# Altium project SCH-45852_C.PrjPcb (part 3 of 3)

## Sheet 11 FREELINK.SchDoc
size 817 x 513 mm
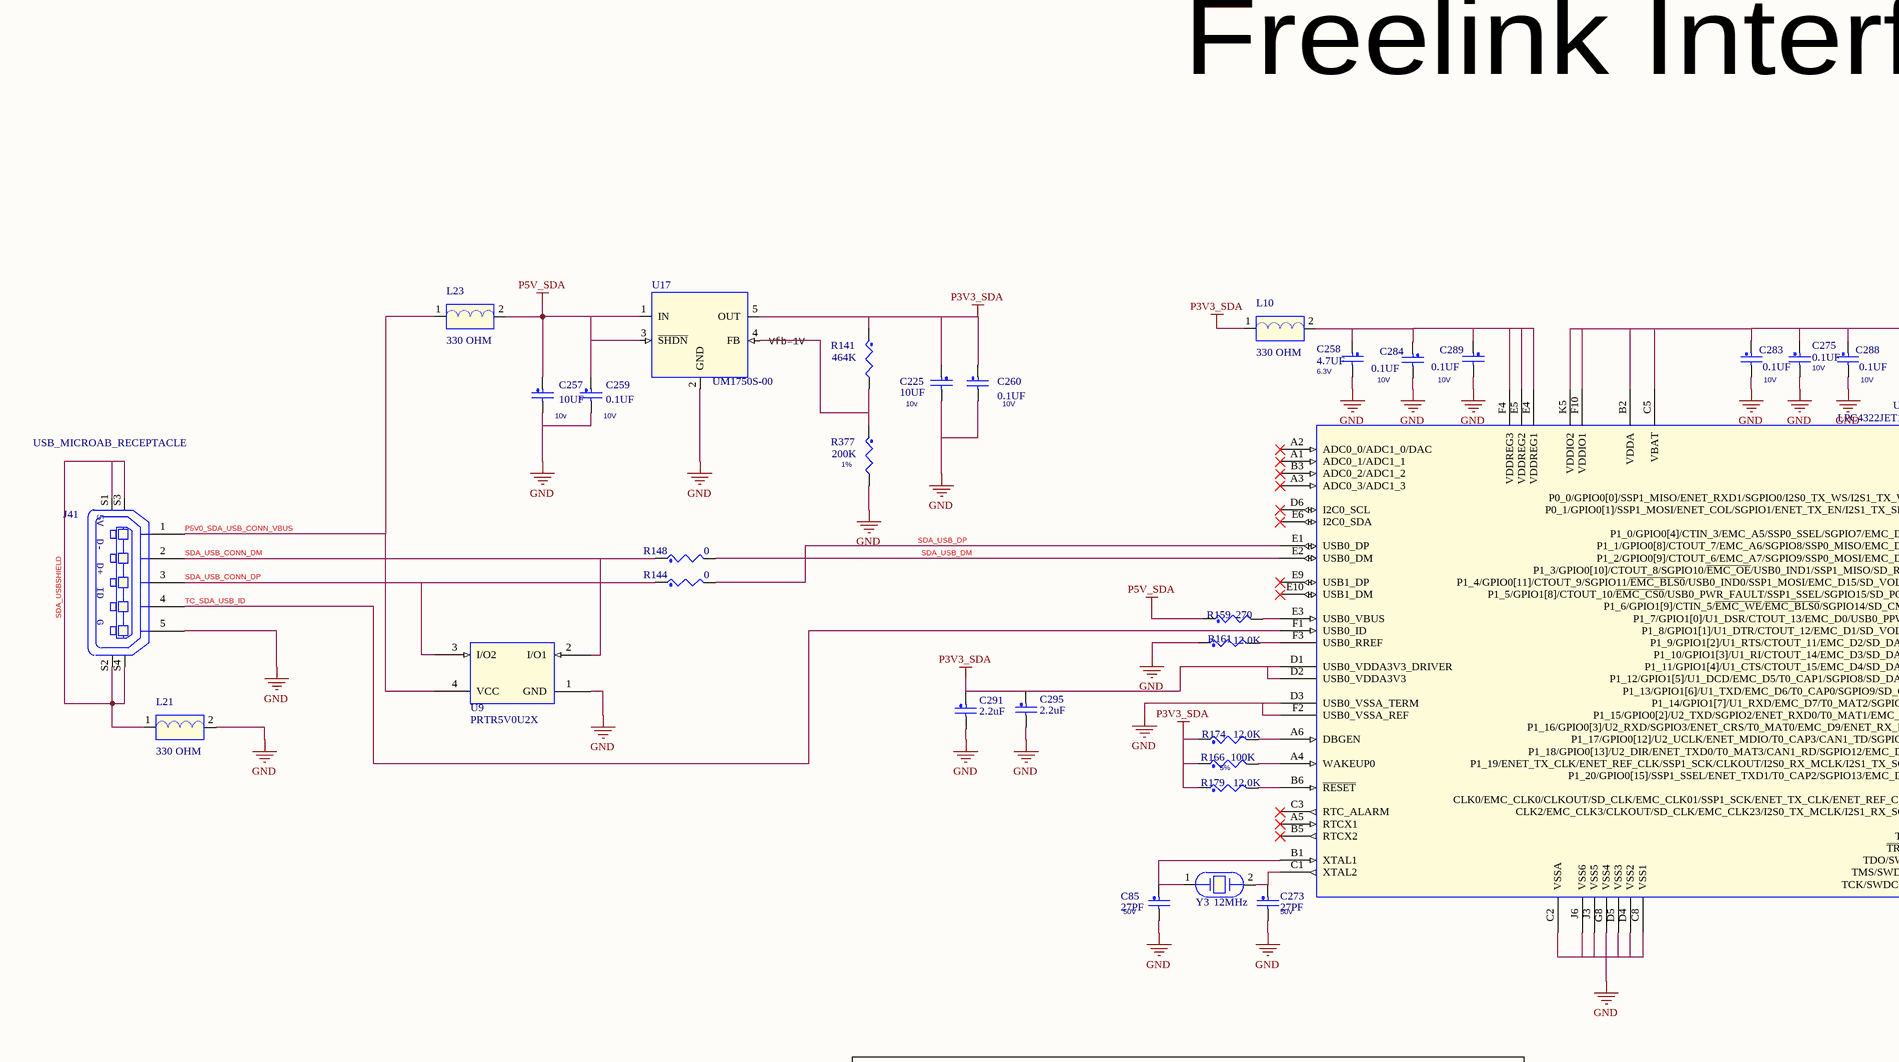
[diagram p12: 11 FREELINK.SchDoc, top left]
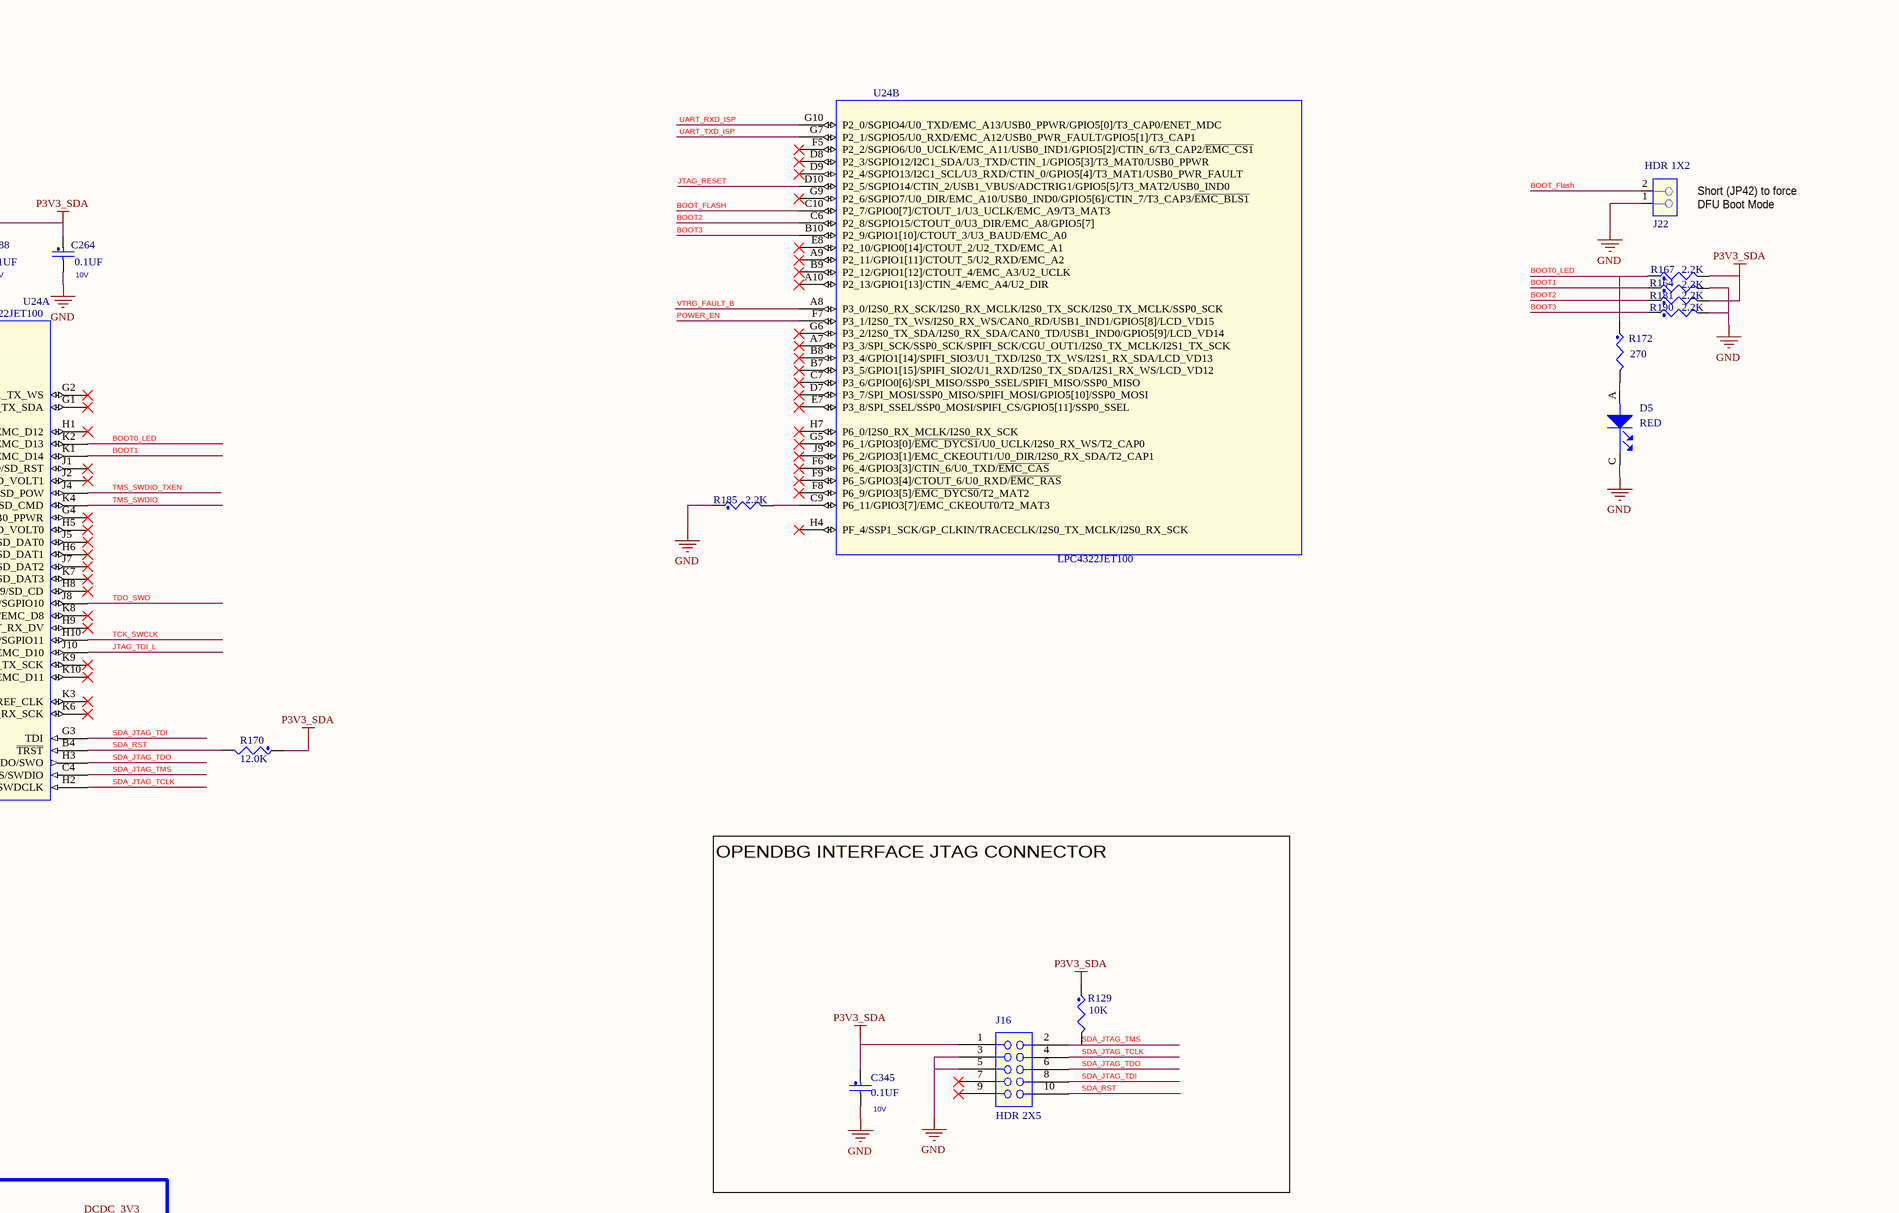
[diagram p13: 11 FREELINK.SchDoc, top right]
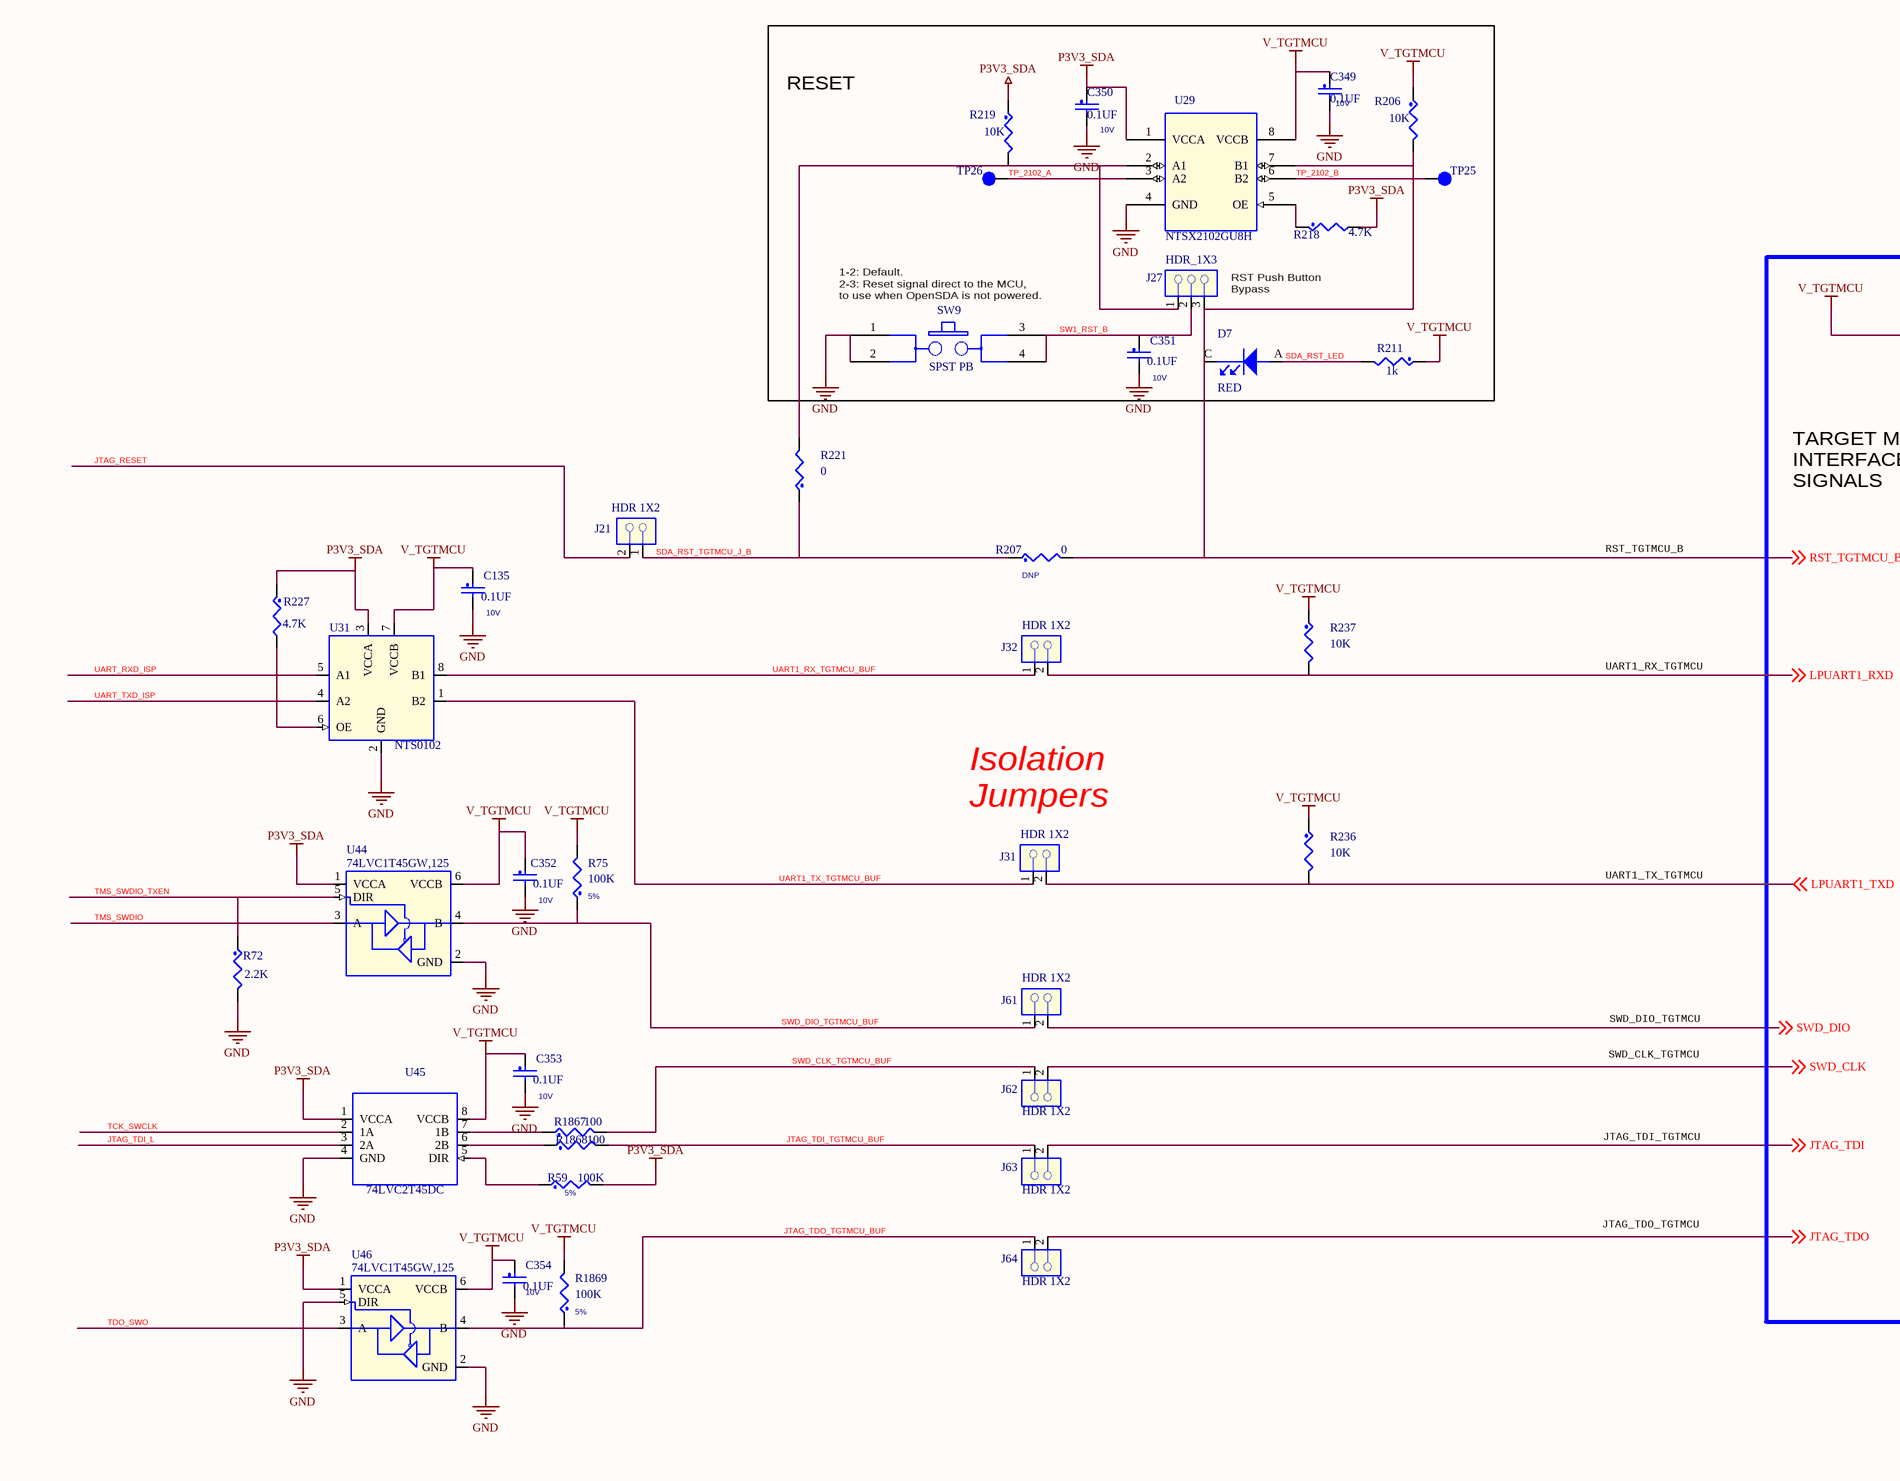
[diagram p14: 11 FREELINK.SchDoc, bottom left]
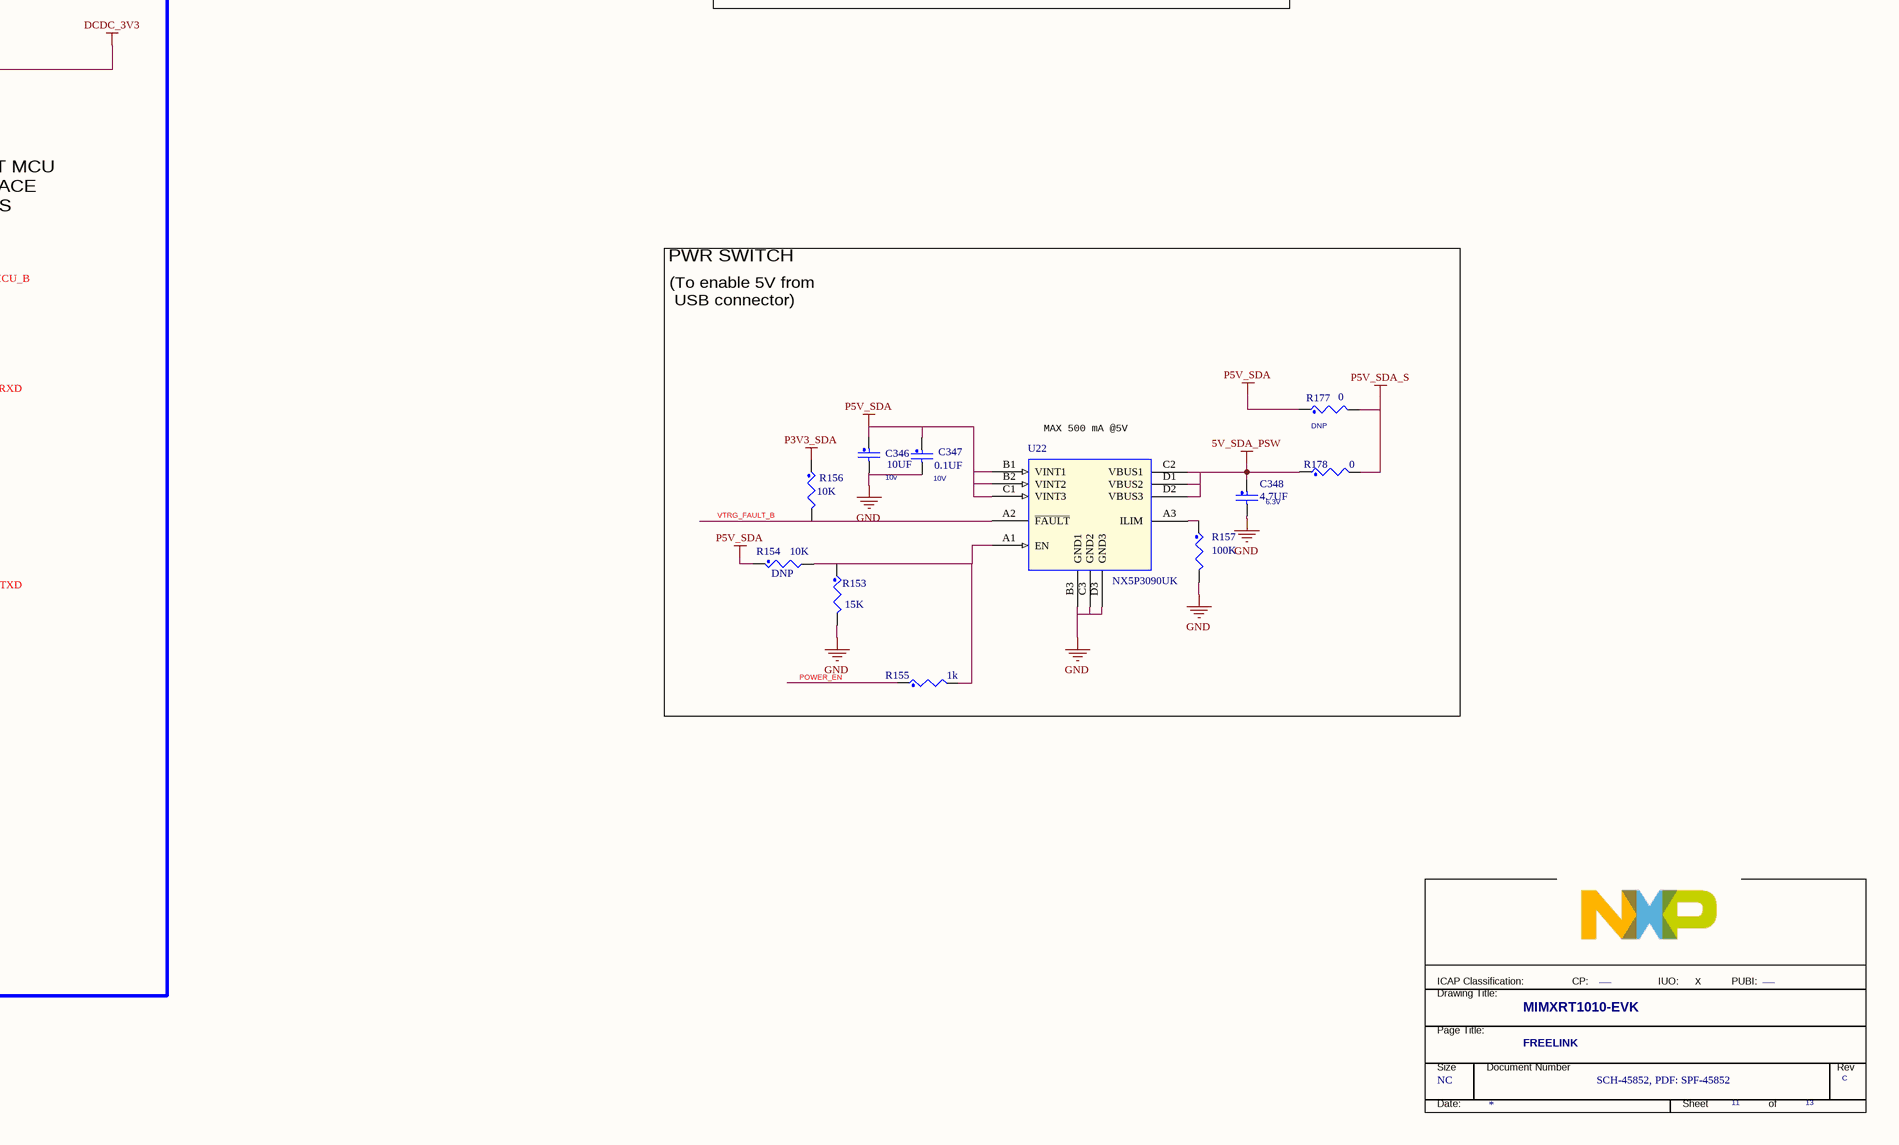
[diagram p15: 11 FREELINK.SchDoc, bottom right]

### Parts
(Parts that share a designator on the sheet are numbered #1, #2 ... from top to bottom, then left to right.)
*#11  PUBI: ___  Doc: SCH-45852, PDF: SPF-45852  RevCode: C  Title: MIMXRT1010-EVK  Page Size: NC  Page Number: 11  Page Count: 13  PageTitle: FREELINK  (hidden comment: TitleBlock_FS)  (graphical)
C85  27PF  VOLTAGE: 50V  [0402_CC]
C135  0.1UF  VOLTAGE: 10V  [0402_CC]
C225  10UF  VOLTAGE: 10v  [CC0603_OV]
C257  10UF  VOLTAGE: 10v  [CC0603_OV]
C258  4.7UF  voltage rating: 6.3V  [0402_CC]
C259  0.1UF  VOLTAGE: 10V  [0402_CC]
C260  0.1UF  VOLTAGE: 10V  [0402_CC]
C264  0.1UF  VOLTAGE: 10V  [0402_CC]
C273  27PF  VOLTAGE: 50V  [0402_CC]
C275  0.1UF  VOLTAGE: 10V  [0402_CC]
C283  0.1UF  VOLTAGE: 10V  [0402_CC]
C284  0.1UF  VOLTAGE: 10V  [0402_CC]
C288  0.1UF  VOLTAGE: 10V  [0402_CC]
C289  0.1UF  VOLTAGE: 10V  [0402_CC]
C291  2.2uF  [0402_CC]
C295  2.2uF  [0402_CC]
C345  0.1UF  VOLTAGE: 10V  [0402_CC]
C346  10UF  VOLTAGE: 10v  [CC0603_OV]
C347  0.1UF  VOLTAGE: 10V  [0402_CC]
C348  4.7UF  VOLTAGE: 6.3V  [0402_CC]
C349  0.1UF  VOLTAGE: 10V  [0402_CC]
C350  0.1UF  VOLTAGE: 10V  [0402_CC]
C351  0.1UF  VOLTAGE: 10V  [0402_CC]
C352  0.1UF  VOLTAGE: 10V  [0402_CC]
C353  0.1UF  VOLTAGE: 10V  [0402_CC]
C354  0.1UF  VOLTAGE: 10V  [0402_CC]
D5  RED  [LED_0603]
D7  RED  [LED_0603]
J16  HDR 2X5  [hdr205_50_th]
J21  HDR 1X2  [HDR102]
J22  HDR 1X2  [HDR102]
J27  HDR_1X3  [HDR103]
J31  HDR 1X2  [HDR102]
J32  HDR 1X2  [HDR102]
J41  USB_MICROAB_RECEPTACLE  [con_usb5_microab_0p65_sm]
J61  HDR 1X2  [HDR102]
J62  HDR 1X2  [HDR102]
J63  HDR 1X2  [HDR102]
J64  HDR 1X2  [HDR102]
L10  330 OHM  [ind_1608]
L21  330 OHM  [ind_1608]
L23  330 OHM  [ind_1608]
R59  100K  Tolerance: 5%  [0402_CC]
R72  2.2K  [0402_CC]
R75  100K  Tolerance: 5%  [0402_CC]
R129  10K  [0402_CC]
R141  464K  [0402_CC]
R144  0  [0402_CC]
R148  0  [0402_CC]
R153  15K  [0402_CC]
R154  10K  ASSY_OPT: DNP  [0402_CC]
R155  1k  [0402_CC]
R156  10K  [0402_CC]
R157  100K  [0402_CC]
R159  270  [0402_CC]
R161  12.0K  [0402_CC]
R164  2.2K  [0402_CC]
R166  100K  Tolerance: 5%  [0402_CC]
R167  2.2K  [0402_CC]
R170  12.0K  [0402_CC]
R172  270  [0402_CC]
R174  12.0K  [0402_CC]
R177  0  ASSY_OPT: DNP  [0402_CC]
R178  0  [0402_CC]
R179  12.0K  [0402_CC]
R181  2.2K  [0402_CC]
R185  2.2K  [0402_CC]
R190  2.2K  [0402_CC]
R206  10K  [0402_CC]
R207  0  ASSY_OPT: DNP  [0402_CC]
R211  1k  [0402_CC]
R218  4.7K  [0402_CC]
R219  10K  [0402_CC]
R221  0  [0402_CC]
R227  4.7K  [0402_CC]
R236  10K  [0402_CC]
R237  10K  [0402_CC]
R377  200K  Tolerance: 1%  [0402_CC]
R1867  100  [0402_CC]
R1868  100  [0402_CC]
R1869  100K  Tolerance: 5%  [0402_CC]
SW9  SPST PB  [SW4_PB_ESW_SM_P177]
TP25  TPAD_030  [TPAD_030]  (value not drawn)
TP26  TPAD_030  [TPAD_030]  (value not drawn)
U9  PRTR5V0U2X  [SOT143B]
U17  UM1750S-00  [sot23-5_a]
U22  NX5P3090UK  [wlcsp12_0p4_1p38x1p68mm_smdp]
U24  LPC4322JET100  [fbga100_0p8_9x9]  (parts A,B of 2)
U29  NTSX2102GU8H  [SO-8]
U31  NTS0102  [tssop8_a]
U44  74LVC1T45GW,125  [SOT-363_0P65_SMT]
U45  74LVC2T45DC  [SSOP8_DCU]
U46  74LVC1T45GW,125  [SOT-363_0P65_SMT]
Y3  12MHz  [xtl2_11p6x4p85_sm]

### Blocks framed on the sheet
OPENDBG INTERFACE JTAG CONNECTOR: C345 J16 R129
RESET: C349-C351 D7 J27 R206 R211 R218 R219 SW9 TP25 TP26 U29
PWR SWITCH: C346-C348 R153-R157 R177 R178 U22

### Nets
5V_SDA_PSW: C348.1 R178.1 U22.C2(VBUS1) U22.D1(VBUS2) U22.D2(VBUS3)
DCDC_3V3: C135.1 C349.1 C352.1 C353.1 C354.1 R75.2 R206.1 R211.1 R236.1 R237.1 R1869.2 U29.8(VCCB) U31.7(VCCB) U44.6(VCCB) U45.8(VCCB) U46.6(VCCB)  [also labelled V_TGTMCU]
GND: C85.2 C135.2 C225.2 C257.2 C258.2 C259.2 C260.2 C264.2 C273.2 C275.2 C283.2 C284.2 C288.2 C289.2 C291.2 C295.2 C345.2 C346.2 C347.2 C348.2 C349.2 C350.2 C351.2 C352.2 C353.2 C354.2 D5.C(CATHODE) J16.3(A2) J16.5(A3) J22.1 J41.5(P5) L21.2 R72.2 R153.2 R157.2 R161.1 R164.2 R185.1 R190.2 R377.2 SW9.1(A1) SW9.2(A2) U9.1(GND) U17.2(GND) U22.B3(GND1) U22.C3(GND2) U22.D3(GND3) U24.C2(VSSA) U24.C8(VSS1) U24.D3(USB0_VSSA_TERM) U24.D4(VSS2) U24.D5(VSS3) U24.F2(USB0_VSSA_REF) U24.G8(VSS4) U24.J3(VSS5) U24.J6(VSS6) U29.4(GND) U31.2(GND) U44.2(GND) U45.4(GND) U46.2(GND) U46.5(DIR)
P3V3_SDA: C225.1 C260.1 C264.1 C275.1 C283.1 C288.1 C291.1 C295.1 C345.1 C350.1 J16.1(A1) L10.1 R59.2 R129.1 R141.1 R156.1 R166.1 R167.2 R170.1 R174.1 R179.1 R181.2 R218.2 R219.1 R227.1 U17.5(OUT) U24.B2(VDDA) U24.C5(VBAT) U24.D1(USB0_VDDA3V3_DRIVER) U24.D2(USB0_VDDA3V3) U24.F10(VDDIO1) U24.K5(VDDIO2) U29.1(VCCA) U31.3(VCCA) U44.1(VCCA) U45.1(VCCA) U46.1(VCCA)
P5V_SDA: C257.1 C259.1 C346.1 C347.1 L23.2 R154.1 R159.1 R177.1 U17.1(IN) U17.3(~{SHDN}) U22.B1(VINT1) U22.B2(VINT2) U22.C1(VINT3)
P5V_SDA_S: R177.2 R178.2
BOOT0_LED: R167.1 R172.1 U24.K2(P1_1/GPIO0[8]/CTOUT_7/EMC_A6/SGPIO8/SSP0_MISO/EMC_D13)
BOOT1: R164.1 U24.K1(P1_2/GPIO0[9]/CTOUT_6/EMC_A7/SGPIO9/SSP0_MOSI/EMC_D14)
BOOT2: R181.1 U24.C6(P2_8/SGPIO15/CTOUT_0/U3_DIR/EMC_A8/GPIO5[7])
BOOT3: R190.1 U24.B10(P2_9/GPIO1[10]/CTOUT_3/U3_BAUD/EMC_A0)
BOOT_Flash: J22.2 U24.C10(P2_7/GPIO0[7]/CTOUT_1/U3_UCLK/EMC_A9/T3_MAT3)
JTAG_RESET: J21.2 U24.D10(P2_5/SGPIO14/CTIN_2/USB1_VBUS/ADCTRIG1/GPIO5[5]/T3_MAT2/USB0_IND0)
JTAG_TDI: J63.2 ; off-sheet JTAG_TDI
JTAG_TDI_L: U24.J10(P1_18/GPIO0[13]/U2_DIR/ENET_TXD0/T0_MAT3/CAN1_RD/SGPIO12/EMC_D10) U45.3(2A)
JTAG_TDI_TGTMCU_BUF: J63.1 R1868.2
JTAG_TDO: J64.2 ; off-sheet JTAG_TDO
JTAG_TDO_TGTMCU_BUF: J64.1 R1869.1 U46.4(B)
LPUART1_RXD: J32.2 R237.2 ; off-sheet LPUART1_RXD
LPUART1_TXD: J31.2 R236.2 ; off-sheet LPUART1_TXD
P5V0_SDA_USB_CONN_VBUS: J41.1(P1) L23.1 U9.4(VCC)
POWER_EN: R155.1 U24.F7(P3_1/I2S0_TX_WS/I2S0_RX_WS/CAN0_RD/USB1_IND1/GPIO5[8]/LCD_VD15)
RST_TGTMCU_B: D7.C(CATHODE) J27.3 R206.2 R207.2 U29.7(B1) ; off-sheet RST_TGTMCU_B  [project net POR_B]
SDA_JTAG_TCLK: J16.4(B2) U24.H2(TCK/SWDCLK)
SDA_JTAG_TDI: J16.8(B4) U24.G3(TDI)
SDA_JTAG_TDO: J16.6(B3) U24.H3(TDO/SWO)
SDA_JTAG_TMS: J16.2(B1) R129.2 U24.C4(TMS/SWDIO)
SDA_RST: J16.10(B5) R170.2 U24.B4(~{TRST})
SDA_RST_LED: D7.A(ANODE) R211.2
SDA_RST_TGTMCU_J_B: J21.1 R207.1 R221.1
SDA_USB_CONN_DM: J41.2(P2) R148.1 U9.2(I/O1)
SDA_USB_CONN_DP: J41.3(P3) R144.1 U9.3(I/O2)
SDA_USB_DM: R148.2 U24.E2(USB0_DM)
SDA_USB_DP: R144.2 U24.E1(USB0_DP)
SDA_USBSHIELD: J41.S1(SHLD1) J41.S2(SHLD2) J41.S3(SHLD3) J41.S4(SHLD4) L21.1
SW1_RST_B: C351.1 J27.2 SW9.3(B1) SW9.4(B2)
SWD_CLK: J62.2 ; off-sheet SWD_CLK  [project net JTAG_TCK]
SWD_CLK_TGTMCU_BUF: J62.1 R1867.2
SWD_DIO: J61.2 ; off-sheet SWD_DIO  [project net JTAG_TMS]
SWD_DIO_TGTMCU_BUF: J61.1 R75.1 U44.4(B)
TC_SDA_USB_ID: J41.4(P4) U24.F1(USB0_ID)
TCK_SWCLK: U24.H10(P1_17/GPIO0[12]/U2_UCLK/ENET_MDIO/T0_CAP3/CAN1_TD/SGPIO11) U45.2(1A)
TDO_SWO: U24.J8(P1_14/GPIO1[7]/U1_RXD/EMC_D7/T0_MAT2/SGPIO10) U46.3(A)
TMS_SWDIO: U24.K4(P1_6/GPIO1[9]/CTIN_5/~{EMC_WE}/~{EMC_BLS0}/SGPIO14/SD_CMD) U44.3(A)
TMS_SWDIO_TXEN: R72.1 U24.J4(P1_5/GPIO1[8]/CTOUT_10/~{EMC_CS0}/USB0_PWR_FAULT/SSP1_SSEL/SGPIO15/SD_POW) U44.5(DIR)
TP_2102_A: TP26.1(Pin1) U29.3(A2)
TP_2102_B: TP25.1(Pin1) U29.6(B2)
UART1_RX_TGTMCU_BUF: J32.1 U31.8(B1)
UART1_TX_TGTMCU_BUF: J31.1 U31.1(B2)
UART_RXD_ISP: U24.G10(P2_0/SGPIO4/U0_TXD/EMC_A13/USB0_PPWR/GPIO5[0]/T3_CAP0/ENET_MDC) U31.5(A1)
UART_TXD_ISP: U24.G7(P2_1/SGPIO5/U0_RXD/EMC_A12/USB0_PWR_FAULT/GPIO5[1]/T3_CAP1) U31.4(A2)
VTRG_FAULT_B: R156.2 U22.A2(~{FAULT}) U24.A8(P3_0/I2S0_RX_SCK/I2S0_RX_MCLK/I2S0_TX_SCK/I2S0_TX_MCLK/SSP0_SCK)
NetC85_1: C85.1 U24.B1(XTAL1) Y3.1
NetC258_1: C258.1 C284.1 C289.1 L10.2 U24.E4(VDDREG1) U24.E5(VDDREG2) U24.F4(VDDREG3)
NetC273_1: C273.1 U24.C1(XTAL2) Y3.2
NetD5_A: D5.A(ANODE) R172.2
NetJ27_1: J27.1 R219.2 R221.2 U29.2(A1)
NetR59_1: R59.1 U45.5(DIR)
NetR141_2: R141.2 R377.1 U17.4(FB)
NetR153_1: R153.1 R154.2 R155.2 U22.A1(EN)
NetR157_1: R157.1 U22.A3(ILIM)
NetR159_2: R159.2 U24.E3(USB0_VBUS)
NetR161_2: R161.2 U24.F3(USB0_RREF)
NetR166_2: R166.2 U24.A4(WAKEUP0)
NetR174_2: R174.2 U24.A6(DBGEN)
NetR179_2: R179.2 U24.B6(~{RESET})
NetR185_2: R185.2 U24.C9(P6_11/GPIO3[7]/EMC_CKEOUT0/T2_MAT3)
NetR218_1: R218.1 U29.5(OE)
NetR227_2: R227.2 U31.6(OE)
NetR1867_1: R1867.1 U45.7(1B)
NetR1868_1: R1868.1 U45.6(2B)

Not connected (* = marked no-connect by the designer): J16 7(A4)* 9(A5)*; U24 A1(ADC0_1/ADC1_1)* A2(ADC0_0/ADC1_0/DAC)* A3(ADC0_3/ADC1_3)* A5(RTCX1)* A7(P3_3/SPI_SCK/SSP0_SCK/SPIFI_SCK/CGU_OUT1/I2S0_TX_MCLK/I2S1_TX_SCK)* A9(P2_11/GPIO1[11]/CTOUT_5/U2_RXD/EMC_A2)* A10(P2_13/GPIO1[13]/CTIN_4/EMC_A4/U2_DIR)* B3(ADC0_2/ADC1_2)* B5(RTCX2)* B7(P3_5/GPIO1[15]/SPIFI_SIO2/U1_RXD/I2S0_TX_SDA/I2S1_RX_WS/LCD_VD12)* B8(P3_4/GPIO1[14]/SPIFI_SIO3/U1_TXD/I2S0_TX_WS/I2S1_RX_SDA/LCD_VD13)* B9(P2_12/GPIO1[12]/CTOUT_4/EMC_A3/U2_UCLK)* C3(RTC_ALARM)* C7(P3_6/GPIO0[6]/SPI_MISO/SSP0_SSEL/SPIFI_MISO/SSP0_MISO)* D6(I2C0_SCL)* D7(P3_7/SPI_MOSI/SSP0_MISO/SPIFI_MOSI/GPIO5[10]/SSP0_MOSI)* D8(P2_3/SGPIO12/I2C1_SDA/U3_TXD/CTIN_1/GPIO5[3]/T3_MAT0/USB0_PPWR)* D9(P2_4/SGPIO13/I2C1_SCL/U3_RXD/CTIN_0/GPIO5[4]/T3_MAT1/USB0_PWR_FAULT)* E6(I2C0_SDA)* E7(P3_8/SPI_SSEL/SSP0_MOSI/SPIFI_CS/GPIO5[11]/SSP0_SSEL)* E8(P2_10/GPIO0[14]/CTOUT_2/U2_TXD/EMC_A1)* E9(USB1_DP)* E10(USB1_DM)* F5(P2_2/SGPIO6/U0_UCLK/EMC_A11/USB0_IND1/GPIO5[2]/CTIN_6/T3_CAP2/~{EMC_CS1})* F6(P6_4/GPIO3[3]/CTIN_6/U0_TXD/~{EMC_CAS})* F8(P6_9/GPIO3[5]/~{EMC_DYCS0}/T2_MAT2)* F9(P6_5/GPIO3[4]/CTOUT_6/U0_RXD/~{EMC_RAS})* G1(P0_1/GPIO0[1]/SSP1_MOSI/ENET_COL/SGPIO1/ENET_TX_EN/I2S1_TX_SDA)* G2(P0_0/GPIO0[0]/SSP1_MISO/ENET_RXD1/SGPIO0/I2S0_TX_WS/I2S1_TX_WS)* G4(P1_7/GPIO1[0]/U1_DSR/CTOUT_13/EMC_D0/USB0_PPWR)* G5(P6_1/GPIO3[0]/~{EMC_DYCS1}/U0_UCLK/I2S0_RX_WS/T2_CAP0)* G6(P3_2/I2S0_TX_SDA/I2S0_RX_SDA/CAN0_TD/USB1_IND0/GPIO5[9]/LCD_VD14)* G9(P2_6/SGPIO7/U0_DIR/EMC_A10/USB0_IND0/GPIO5[6]/CTIN_7/T3_CAP3/~{EMC_BLS1})* H1(P1_0/GPIO0[4]/CTIN_3/EMC_A5/SSP0_SSEL/SGPIO7/EMC_D12)* H4(PF_4/SSP1_SCK/GP_CLKIN/TRACECLK/I2S0_TX_MCLK/I2S0_RX_SCK)* H5(P1_8/GPIO1[1]/U1_DTR/CTOUT_12/EMC_D1/SD_VOLT0)* H6(P1_10/GPIO1[3]/U1_RI/CTOUT_14/EMC_D3/SD_DAT1)* H7(P6_0/I2S0_RX_MCLK/I2S0_RX_SCK)* H8(P1_13/GPIO1[6]/U1_TXD/EMC_D6/T0_CAP0/SGPIO9/SD_CD)* H9(P1_16/GPIO0[3]/U2_RXD/SGPIO3/ENET_CRS/T0_MAT0/EMC_D9/ENET_RX_DV)* J1(P1_3/GPIO0[10]/CTOUT_8/SGPIO10/~{EMC_OE}/USB0_IND1/SSP1_MISO/SD_RST)* J2(P1_4/GPIO0[11]/CTOUT_9/SGPIO11/~{EMC_BLS0}/USB0_IND0/SSP1_MOSI/EMC_D15/SD_VOLT1)* J5(P1_9/GPIO1[2]/U1_RTS/CTOUT_11/EMC_D2/SD_DAT0)* J7(P1_11/GPIO1[4]/U1_CTS/CTOUT_15/EMC_D4/SD_DAT2)* J9(P6_2/GPIO3[1]/EMC_CKEOUT1/U0_DIR/I2S0_RX_SDA/T2_CAP1)* K3(CLK0/EMC_CLK0/CLKOUT/SD_CLK/EMC_CLK01/SSP1_SCK/ENET_TX_CLK/ENET_REF_CLK)* K6(CLK2/EMC_CLK3/CLKOUT/SD_CLK/EMC_CLK23/I2S0_TX_MCLK/I2S1_RX_SCK)* K7(P1_12/GPIO1[5]/U1_DCD/EMC_D5/T0_CAP1/SGPIO8/SD_DAT3)* K8(P1_15/GPIO0[2]/U2_TXD/SGPIO2/ENET_RXD0/T0_MAT1/EMC_D8)* K9(P1_19/ENET_TX_CLK/ENET_REF_CLK/SSP1_SCK/CLKOUT/I2S0_RX_MCLK/I2S1_TX_SCK)* K10(P1_20/GPIO0[15]/SSP1_SSEL/ENET_TXD1/T0_CAP2/SGPIO13/EMC_D11)*

### Notes on the sheet
- Freelink Interface
- Short (JP42) to force
  DFU Boot Mode
- (near U17) Vfb=1V
- (near SW9) 1-2: Default.
  2-3: Reset signal direct to the MCU,
  to use when OpenSDA is not powered.
- RST Push Button
  Bypass
- TARGET MCU
  INTERFACE
  SIGNALS
- RST_TGTMCU_B
- (To enable 5V from
  USB connector)
- UART1_RX_TGTMCU
- Isolation
  Jumpers
- (near U22) MAX 500 mA @5V
- UART1_TX_TGTMCU
- SWD_DIO_TGTMCU
- SWD_CLK_TGTMCU
- JTAG_TDI_TGTMCU
- JTAG_TDO_TGTMCU
- X
- (in symbol TitleBlock_FS) ICAP Classification:; CP:; IUO:; PUBI:; Drawing Title:; Page Title:; Size; Document Number; Rev; Date:; Sheet; of
- (in symbol USB_MINI_AB_RECEPTACLE) 5V; D-; D+; ID; G

### Library data of the parts
*#11 = TitleBlock_FS: FIUO: _X_; OrgAddr2: Austin, TX 78735-8598; OrgAddr1: 6501 William Cannon Drive West; OrgName: Freescale Semiconductor; FCP: ___; Page Create Date: March  8, 1995; Page Modify Date: *
C85 = CAP_NP: CAP CER 27PF 50V 5% C0G 0402; CLASS: DISCRETE; FPLIST: CC0402_25,CC0402_HD,0402_CC; CAD_APPROVED: Yes; MFG_PN01: C0402C270J5GAC; MFG_NAME01: KEMET; AGILE_PN: 150-30109; HEIGHT: .55mm; ROHS: Yes; Tolerance: 5%; PCB Footprint: 0402_CC
C135 C283 C284 C345 C352-C354 = CAP_NP: CAP CER 0.1UF 10V 10% X5R 0402; CLASS: DISCRETE; AGILE_PN: 150-75634; MFG_NAME01: YAGEO AMERICA; MFG_PN01: CC0402KRX5R6BB104; CAD_APPROVED: Yes; FPLIST: CC0402_25,CC0402_HD,0402_CC; Tolerance: 10%; ROHS: Yes; HEIGHT: 0.64MM; PCB Footprint: 0402_CC
C225 C346 = CAP_NP: CAP CER 10UF 10V 10% X5R 0603; CLASS: DISCRETE; FPLIST: CC0603_OV,CC0603,0603_CC; CAD_APPROVED: Yes; Temp_Range: -55¡ãC ~ 85¡ãC; MFG_PN01: GRM188R61A106KE69D; MFG_NAME01: MURATA; AGILE_PN: 150-78675; HEIGHT: 1.016MM; ROHS: Yes; Tolerance: 10%; PCB Footprint: CC0603_OV
C257 = CAP_NP: CAP CER 10UF 10V 10% X5R 0603; CLASS: DISCRETE; AGILE_PN: 150-78675; MFG_NAME01: MURATA; MFG_PN01: GRM188R61A106KE69D; Temp_Range: -55¡ãC ~ 85¡ãC; CAD_APPROVED: Yes; FPLIST: CC0603_OV,CC0603,0603_CC; Tolerance: 10%; ROHS: Yes; HEIGHT: 1.016MM; PCB Footprint: CC0603_OV
C258 C348 = CAP_NP: CAP CER 4.7UF 6.3V 20% X5R 0402; CLASS: DISCRETE; AGILE_PN: 150-78463; MFG_NAME01: TDK; MFG_PN01: C1005X5R0J475M050BC; CAD_APPROVED: Yes; FPLIST: CC0402_25,CC0402_HD,0402_CC; Tolerance: 20%; ROHS: Yes; HEIGHT: 0.65MM; PCB Footprint: 0402_CC
  C258: VOLTAGE: 6.3V
  C348: TOL: 20%
C259 C260 C264 C275 C288 C289 C347 C349-C351 = CAP_NP: CAP CER 0.1UF 10V 10% X5R 0402; CLASS: DISCRETE; FPLIST: CC0402_25,CC0402_HD,0402_CC; CAD_APPROVED: Yes; MFG_PN01: CC0402KRX5R6BB104; MFG_NAME01: YAGEO AMERICA; AGILE_PN: 150-75634; HEIGHT: 0.64MM; ROHS: Yes; Tolerance: 10%; PCB Footprint: 0402_CC
C273 = CAP_NP: CAP CER 27PF 50V 5% C0G 0402; CLASS: DISCRETE; AGILE_PN: 150-30109; MFG_NAME01: KEMET; MFG_PN01: C0402C270J5GAC; CAD_APPROVED: Yes; FPLIST: CC0402_25,CC0402_HD,0402_CC; Tolerance: 5%; ROHS: Yes; HEIGHT: .55mm; PCB Footprint: 0402_CC
C291 = CAP_NP: CAP CER 2.2uF 6.3V 10% X5R 0402; CLASS: DISCRETE; FPLIST: CC0402_25,CC0402_HD,0402_CC; CAD_APPROVED: Yes; MFG_PN01: GRM155R60J225KE01D; MFG_NAME01: MURATA; AGILE_PN: 150-79454; VOLTAGE: 6.3V; HEIGHT: 0.55MM; ROHS: Yes; Tolerance: 10%; PCB Footprint: 0402_CC
C295 = CAP_NP: CAP CER 2.2uF 6.3V 10% X5R 0402; CLASS: DISCRETE; AGILE_PN: 150-79454; MFG_NAME01: MURATA; MFG_PN01: GRM155R60J225KE01D; CAD_APPROVED: Yes; FPLIST: CC0402_25,CC0402_HD,0402_CC; Tolerance: 10%; ROHS: Yes; HEIGHT: 0.55MM; VOLTAGE: 6.3V; PCB Footprint: 0402_CC
D5 D7 = LED: LED ULTRA BRIGHT RED SGL 30MA 0603; CLASS: IC; AGILE_PN: 370-75079; MFG_NAME01: LITE ON; MFG_PN01: LTST-C190KRKT; CAD_APPROVED: Yes; Temp_Range: -30¡ã C to + 85¡ã C; ROHS: Yes; HEIGHT: 0.9MM; PCB Footprint: LED_0603
J16 = CONN_HDR_5X2: HDR 2X5 TH 50MIL CTR 172H AU 91L; CLASS: IO; AGILE_PN: 210-81466; MFG_NAME01: ANYTRONIC CORPORATION LIMITED; MFG_PN01: 0922S0205011N9T-31RF; Temp_Range: -55DegC to +105DegC; CAD_APPROVED: Yes; ROHS: Yes; HEIGHT: 4.38MM; PCB Footprint: hdr205_50_th
J21 J32 J61 = CONN_HDR_2X1: HDR 1X2 TH 100MIL SP 339H AU 98L; CLASS: IO; AGILE_PN: 210-81490; MFG_NAME01: ANYTRONIC CORPORATION LIMITED; MFG_PN01: 0901S0202011N9T-31RF; Temp_Range: -55¡ãC to +105¡ãC; CAD_APPROVED: Yes; ROHS: Yes; HEIGHT: 8.59MM; PCB Footprint: HDR102
J22 J31 J62-J64 = CONN_HDR_2X1: HDR 1X2 TH 100MIL SP 339H AU 98L; CLASS: IO; CAD_APPROVED: Yes; Temp_Range: -55¡ãC to +105¡ãC; MFG_PN01: 0901S0202011N9T-31RF; MFG_NAME01: ANYTRONIC CORPORATION LIMITED; AGILE_PN: 210-81490; HEIGHT: 8.59MM; ROHS: Yes; PCB Footprint: HDR102
J27 = CONN_HDR_3X1: HDR 1X3 TH 100MIL SP 338H AU 98L; CLASS: IO; AGILE_PN: 210-81491; MFG_NAME01: ANYTRONIC CORPORATION LIMITED; MFG_PN01: 0901S0203011N9T-31RF; Temp_Range: -55¡ãC to +105¡ãC; CAD_APPROVED: Yes; ROHS: Yes; HEIGHT: 8.59MM; PCB Footprint: HDR103
J41 = USB_MINI_AB_RECEPTACLE: CON 5 USB MICRO_AB RA SKT SMT 0.65MM SP 110H AU; CLASS: IO; AGILE_PN: 211-80104; MFG_NAME01: ANYTRONIC CORPORATION LIMITED; MFG_PN01: 23971101#LCP-58RF; Temp_Range: -55&#8451; to 105&#8451;; CAD_APPROVED: Yes; ROHS: Yes; HEIGHT: 2.8MM; PCB Footprint: con_usb5_microab_0p65_sm
L10 = BEAD: IND FER BEAD 330OHM@100MHZ 1.7A 0603; PART_TYPE: FERRITE\BEAD; CLASS: DISCRETE; FPLIST: ind_1608,0603_CC; CAD_APPROVED: Yes; MFG_PN01: MPZ1608S331A; MFG_NAME01: TDK; Tolerance: 25%; AGILE_PN: 180-78156; HEIGHT: 0.95MM; ROHS: Yes; PCB Footprint: ind_1608
L21 L23 = BEAD: IND FER BEAD 330OHM@100MHZ 1.7A 0603; PART_TYPE: FERRITE\BEAD; CLASS: DISCRETE; AGILE_PN: 180-78156; Tolerance: 25%; MFG_NAME01: TDK; MFG_PN01: MPZ1608S331A; CAD_APPROVED: Yes; FPLIST: ind_1608,0603_CC; ROHS: Yes; HEIGHT: 0.95MM; PCB Footprint: ind_1608
R59 = RES_Dup1: RES MF 100K 1/16W 5% 0402; CLASS: DISCRETE; FPLIST: RC0402_25,RC0402_HD,0402_CC; CAD_APPROVED: Yes; MFG_PN01: CR0402-16W-104JT; MFG_NAME01: VENKEL COMPANY; AGILE_PN: 470-75597; Temp_Range: -55C to +155C; HEIGHT: 0.40 MM; TOL: 5%; ROHS: Yes; PCB Footprint: 0402_CC
R72 R167 R185 = RES_Dup1: RES MF 2.2K 1/16W 5% 0402; CLASS: DISCRETE; AGILE_PN: 470-76602; MFG_NAME01: YAGEO AMERICA; MFG_PN01: RC0402JR-072K2L; CAD_APPROVED: Yes; FPLIST: RC0402_25,RC0402_HD,0402_CC; HEIGHT: 0.4 MM; Tolerance: 5%; ROHS: Yes; TOL: 5%; PCB Footprint: 0402_CC
R75 R1869 = RES_Dup1: RES MF 100K 1/16W 5% 0402; CLASS: DISCRETE; AGILE_PN: 470-75597; MFG_NAME01: VENKEL COMPANY; MFG_PN01: CR0402-16W-104JT; CAD_APPROVED: Yes; FPLIST: RC0402_25,RC0402_HD,0402_CC; Temp_Range: -55C to +155C; ROHS: Yes; TOL: 5%; HEIGHT: 0.40 MM; PCB Footprint: 0402_CC
R129 R154 R206 R219 R236 = RES_Dup1: RES MF 10K 1/16W 5% 0402; CLASS: DISCRETE; FPLIST: RC0402_25,RC0402_HD,0402_CC; CAD_APPROVED: Yes; MFG_PN01: CRCW040210K0JNED; MFG_NAME01: VISHAY INTERTECHNOLOGY; AGILE_PN: 470-75557; ROHS: Yes; Tolerance: 5%; HEIGHT: 0.4 MM; PCB Footprint: 0402_CC
  R129 R206 R219: TOL: 5%
R141 = RES_Dup1: RES MF 464K 1/10W 1% AEC-Q200 0402; CLASS: DISCRETE; Temp_Range: -55C to +155C; AGILE_PN: 470-31135; MFG_NAME01: KOA SPEER; MFG_PN01: RK73H1ETTP4643F; CAD_APPROVED: Yes; FPLIST: RC0402_25,RC0402_HD,0402_CC; Tolerance: 1%; ROHS: Yes; HEIGHT: 0.40 MM; PCB Footprint: 0402_CC
R144 R177 = RES_Dup1: RES MF ZERO OHM 1/16W 5% 0402; CLASS: DISCRETE; FPLIST: RC0402_25,RC0402_HD,RC0402_X2,0402_CC; CAD_APPROVED: Yes; MFG_PN01: MCR01MZPJ000; MFG_NAME01: ROHM; AGILE_PN: 470-75394; ROHS: Yes; Tolerance: 5%; HEIGHT: 0.45 MM; PCB Footprint: 0402_CC
R148 R178 R207 R221 = RES_Dup1: RES MF ZERO OHM 1/16W 5% 0402; CLASS: DISCRETE; AGILE_PN: 470-75394; MFG_NAME01: ROHM; MFG_PN01: MCR01MZPJ000; CAD_APPROVED: Yes; FPLIST: RC0402_25,RC0402_HD,RC0402_X2,0402_CC; HEIGHT: 0.45 MM; Tolerance: 5%; ROHS: Yes; PCB Footprint: 0402_CC
R153 = RES_Dup1: RES MF 15K  1/16W 1% 0402; CLASS: DISCRETE; AGILE_PN: 470-30965; MFG_NAME01: WALSIN TECHNOLOGY CORP.; MFG_PN01: WR04X1502FTL; CAD_APPROVED: Yes; FPLIST: RC0402_25,RC0402_HD,0402_CC; SIGNAL_MODEL: DEFAULT_RESISTOR_15000OHM_2_1; HEIGHT: 0.40 MM; TOL: 1%; Tolerance: 1%; ROHS: Yes; PCB Footprint: 0402_CC
R155 R211 = RES_Dup1: RES MF 1.0K 1/16W 5% 0402; CLASS: DISCRETE; AGILE_PN: 470-75555; MFG_NAME01: VISHAY INTERTECHNOLOGY; MFG_PN01: CRCW04021K00JNED; CAD_APPROVED: Yes; FPLIST: RC0402_25,RC0402_HD,RC0402_X2,0402_CC; Tolerance: 5%; ROHS: Yes; HEIGHT: 0.41mm; PCB Footprint: 0402_CC
R156 R237 = RES_Dup1: RES MF 10K 1/16W 5% 0402; CLASS: DISCRETE; AGILE_PN: 470-75557; MFG_NAME01: VISHAY INTERTECHNOLOGY; MFG_PN01: CRCW040210K0JNED; CAD_APPROVED: Yes; FPLIST: RC0402_25,RC0402_HD,0402_CC; HEIGHT: 0.4 MM; Tolerance: 5%; ROHS: Yes; PCB Footprint: 0402_CC
  R156: TOL: 5%
R157 = RES_Dup1: RES MF 100K 1/16W 1% 0402; CLASS: DISCRETE; FPLIST: RC0402_25,RC0402_HD,0402_CC; CAD_APPROVED: Yes; MFG_PN01: NRCL04F1003TRF; MFG_NAME01: NIC COMPONENTS CORP; AGILE_PN: 470-76240; HEIGHT: 0.4MM; ROHS: Yes; Tolerance: 1%; PCB Footprint: 0402_CC
R159 R172 = RES_Dup1: RES MF 270 OHM 1/16W 5% 0402; CLASS: DISCRETE; FPLIST: RC0402_25,RC0402_HD,0402_CC; CAD_APPROVED: Yes; Temp_Range: -55C to +155C; MFG_PN01: RC0402JR-07270RL; MFG_NAME01: Yageo; AGILE_PN: 470-81890; HEIGHT: 0.4MM; ROHS: Yes; Tolerance: 5%; PCB Footprint: 0402_CC
R161 R179 = RES_Dup1: RES MF 12.0K 1/16W 1% 0402; CLASS: DISCRETE; AGILE_PN: 470-76083; MFG_NAME01: BOURNS; MFG_PN01: CR0402-FX-1202GLF; CAD_APPROVED: Yes; FPLIST: RC0402_25,RC0402_HD,0402_CC; Tolerance: 1%; ROHS: Yes; HEIGHT: 0.4 MM; PCB Footprint: 0402_CC
R164 R181 R190 = RES_Dup1: RES MF 2.2K 1/16W 5% 0402; CLASS: DISCRETE; FPLIST: RC0402_25,RC0402_HD,0402_CC; CAD_APPROVED: Yes; MFG_PN01: RC0402JR-072K2L; MFG_NAME01: YAGEO AMERICA; AGILE_PN: 470-76602; TOL: 5%; ROHS: Yes; Tolerance: 5%; HEIGHT: 0.4 MM; PCB Footprint: 0402_CC
R166 = RES_Dup1: RES MF 100K 1/16W 5% 0402; CLASS: DISCRETE; Temp_Range: -55C to +155C; AGILE_PN: 470-75597; MFG_NAME01: VENKEL COMPANY; MFG_PN01: CR0402-16W-104JT; CAD_APPROVED: Yes; FPLIST: RC0402_25,RC0402_HD,0402_CC; ROHS: Yes; TOL: 5%; HEIGHT: 0.40 MM; PCB Footprint: 0402_CC
R170 R174 = RES_Dup1: RES MF 12.0K 1/16W 1% 0402; CLASS: DISCRETE; FPLIST: RC0402_25,RC0402_HD,0402_CC; CAD_APPROVED: Yes; MFG_PN01: CR0402-FX-1202GLF; MFG_NAME01: BOURNS; AGILE_PN: 470-76083; HEIGHT: 0.4 MM; ROHS: Yes; Tolerance: 1%; PCB Footprint: 0402_CC
R218 = RES_Dup1: RES MF 4.7K 1/16W 5% 0402; CLASS: DISCRETE; SIGNAL_MODEL: DEFAULT_RESISTOR_4700OHM_2_1; FPLIST: RC0402_25,RC0402_HD,0402_CC; CAD_APPROVED: Yes; MFG_PN01: NRCL04J472TRF; MFG_NAME01: NIC COMPONENTS CORP; AGILE_PN: 470-75626; HEIGHT: 0.41mm; TOL: 5%; ROHS: Yes; Tolerance: 5%; PCB Footprint: 0402_CC
R227 = RES_Dup1: RES MF 4.7K 1/16W 5% 0402; CLASS: DISCRETE; AGILE_PN: 470-75626; MFG_NAME01: NIC COMPONENTS CORP; MFG_PN01: NRCL04J472TRF; CAD_APPROVED: Yes; FPLIST: RC0402_25,RC0402_HD,0402_CC; SIGNAL_MODEL: DEFAULT_RESISTOR_4700OHM_2_1; Tolerance: 5%; ROHS: Yes; TOL: 5%; HEIGHT: 0.41mm; PCB Footprint: 0402_CC
R377 = RES_Dup1: RES MF 200K 1/10W 1% AEC-Q200 0402; CLASS: DISCRETE; AGILE_PN: 470-31093; MFG_NAME01: KOA SPEER; MFG_PN01: RK73H1ETTP2003F; CAD_APPROVED: Yes; FPLIST: RC0402_25,RC0402_HD,0402_CC; Temp_Range: -55C to +155C; HEIGHT: 0.40 MM; ROHS: Yes; PCB Footprint: 0402_CC
R1867 = RES_Dup1: RES MF 100 OHM 1/16W 5% 0402; CLASS: DISCRETE; AGILE_PN: 470-82143; MFG_NAME01: YAGEO AMERICA; MFG_PN01: RC0402JR-07100RL; Temp_Range: -55¡ãC to +155¡ãC; CAD_APPROVED: Yes; FPLIST: RC0402_25,RC0402_HD,RC0402_X2,0402_CC; Tolerance: 5%; ROHS: Yes; HEIGHT: 0.45MM; PCB Footprint: 0402_CC
R1868 = RES_Dup1: RES MF 100 OHM 1/16W 5% 0402; CLASS: DISCRETE; FPLIST: RC0402_25,RC0402_HD,RC0402_X2,0402_CC; CAD_APPROVED: Yes; Temp_Range: -55¡ãC to +155¡ãC; MFG_PN01: RC0402JR-07100RL; MFG_NAME01: YAGEO AMERICA; AGILE_PN: 470-82143; HEIGHT: 0.45MM; ROHS: Yes; Tolerance: 5%; PCB Footprint: 0402_CC
SW9 = SW_PB_ESW: SW SPST MOM NO PB TACT 50mA 50V SMT; CLASS: IC; AGILE_PN: 510-77562; MFG_NAME01: E SWITCH; MFG_PN01: TL3301AF260QG/TR; CAD_APPROVED: Yes; ROHS: Yes; HEIGHT: 5MM; PCB Footprint: SW4_PB_ESW_SM_P177
TP25 TP26 = TestLoop: TEST POINT PAD 30MIL DIA SMT, NO PART TO ORDER; CLASS: IO; CAD_APPROVED: Yes; MFG_PN01: NOTACOMPONENT; AGILE_PN: 211-76642; HEIGHT: 0.1MM; ROHS: Yes; MFG_NAME01: NOTACOMPONENT; PCB Footprint: TPAD_030
U9 = PRTR5V0U2X: IC USB ESD PROTECTION 8KV SOT143; AGILE_PN: 315-76725; MFG_NAME01: NEXPERIA; Temp_Range: -40¡ã C to +85¡ã C; CAD_APPROVED: Yes; CLASS: IC; MFG_PN01: PRTR5V0U2X; ROHS: Yes; HEIGHT: 1.1MM; PCB Footprint: SOT143B
U17 = UM1750S-00_5P: IC VREG LDO ADJ 1-5V 350mA 2.5-6V SOT23-5; CAD_APPROVED: Yes; MFG_NAME01: Union Semiconductor, Inc; AGILE_PN: 315-80554; CLASS: IC; HEIGHT: 1.25MM; ROHS: Yes; MFG_PN01: UM1750S-00; PCB Footprint: sot23-5_a
U22 = NX5P3090UK_WLCSP12: IC USB PD TYPE C CURRENT LIMITED PWR SW 2.5-5.5V WLCSP12; AGILE_PN: 312-81574; MFG_NAME01: NXP SEMICONDUCTORS; MFG_PN01: NX5P3090UK,012; CAD_APPROVED: Yes; CLASS: IC; ROHS: Yes; HEIGHT: 0.565 MM; PCB Footprint: wlcsp12_0p4_1p38x1p68mm_smdp
U24 = LPC432_BGA_100P: IC MCU  CORTEX M4 CORE 512kB FLASH 2.4-3.6V BGA100; SWAP_INFO: (S1+S2); SPLIT_INST: TRUE; AGILE_PN: 344-02176; MFG_NAME01: NXP SEMICONDUCTORS; MFG_PN01: LPC4322JET100E; CAD_APPROVED: Yes; CLASS: IC; ROHS: Yes; HEIGHT: 1.2MM; PCB Footprint: fbga100_0p8_9x9
U29 = NTSX2102GU8H_8P: IC DUAL SUPPLY XCVR 50 MBPS 5.5V XQFN8; CAD_APPROVED: Yes; MFG_NAME01: NXP SEMICONDUCTORS; AGILE_PN: 312-80763; PCB Footprint: xqfn8_1p45x1p25mm; CLASS: IC; HEIGHT: 0.5MM; ROHS: Yes; MFG_PN01: NTSX2102GU8H; VOLTAGE: 5.5V
U31 = NTB0102_8P: IC XCVR 2-BIT 1.65-3.6V/2.3-5.5V TSSOP8; CAD_APPROVED: Yes; MFG_PN01: NTS0102DP; MFG_NAME01: NXP SEMICONDUCTORS; AGILE_PN: 312-80889; CLASS: IC; HEIGHT: 1.1MM; ROHS: Yes; PCB Footprint: tssop8_a
U44 U46 = 74LVCH1T45_6P: IC XCVR XLATING DUAL 3-STATE 1.2- 5.5V TSSOP6; AGILE_PN: 312-81277; MFG_NAME01: NEXPERIA; CAD_APPROVED: Yes; CLASS: IC; MFG_PN01: 74LVC1T45GW,125; ROHS: Yes; HEIGHT: 1.1MM; PCB Footprint: SOT-363_0P65_SMT
U45 = 74LVC2T45DC_8P: IC TRANSLATING XCVR DUAL BIT/SUPPLY TS 1.2-5.5V VSSOP8; AGILE_PN: 312-81751; MFG_NAME01: NEXPERIA; Temp_Range: -40¡ãC to +125¡ãC; CAD_APPROVED: Yes; CLASS: IC; MFG_PN01: 74LVC2T45DC; ROHS: Yes; HEIGHT: 1MM; PCB Footprint: SSOP8_DCU
Y3 = XTAL: XTAL 12MHZ RSN -- 18PF 30PPM SMT; CLASS: IC; CAD_APPROVED: Yes; MFG_PN01: ABLS2-12.000MHZ-D4Y-T; MFG_NAME01: ABRACON CORP; AGILE_PN: 230-78082; HEIGHT: 3.3MM; ROHS: Yes; PCB Footprint: xtl2_11p6x4p85_sm

## Sheet 12 BOOT.SchDoc
size 513 x 386 mm
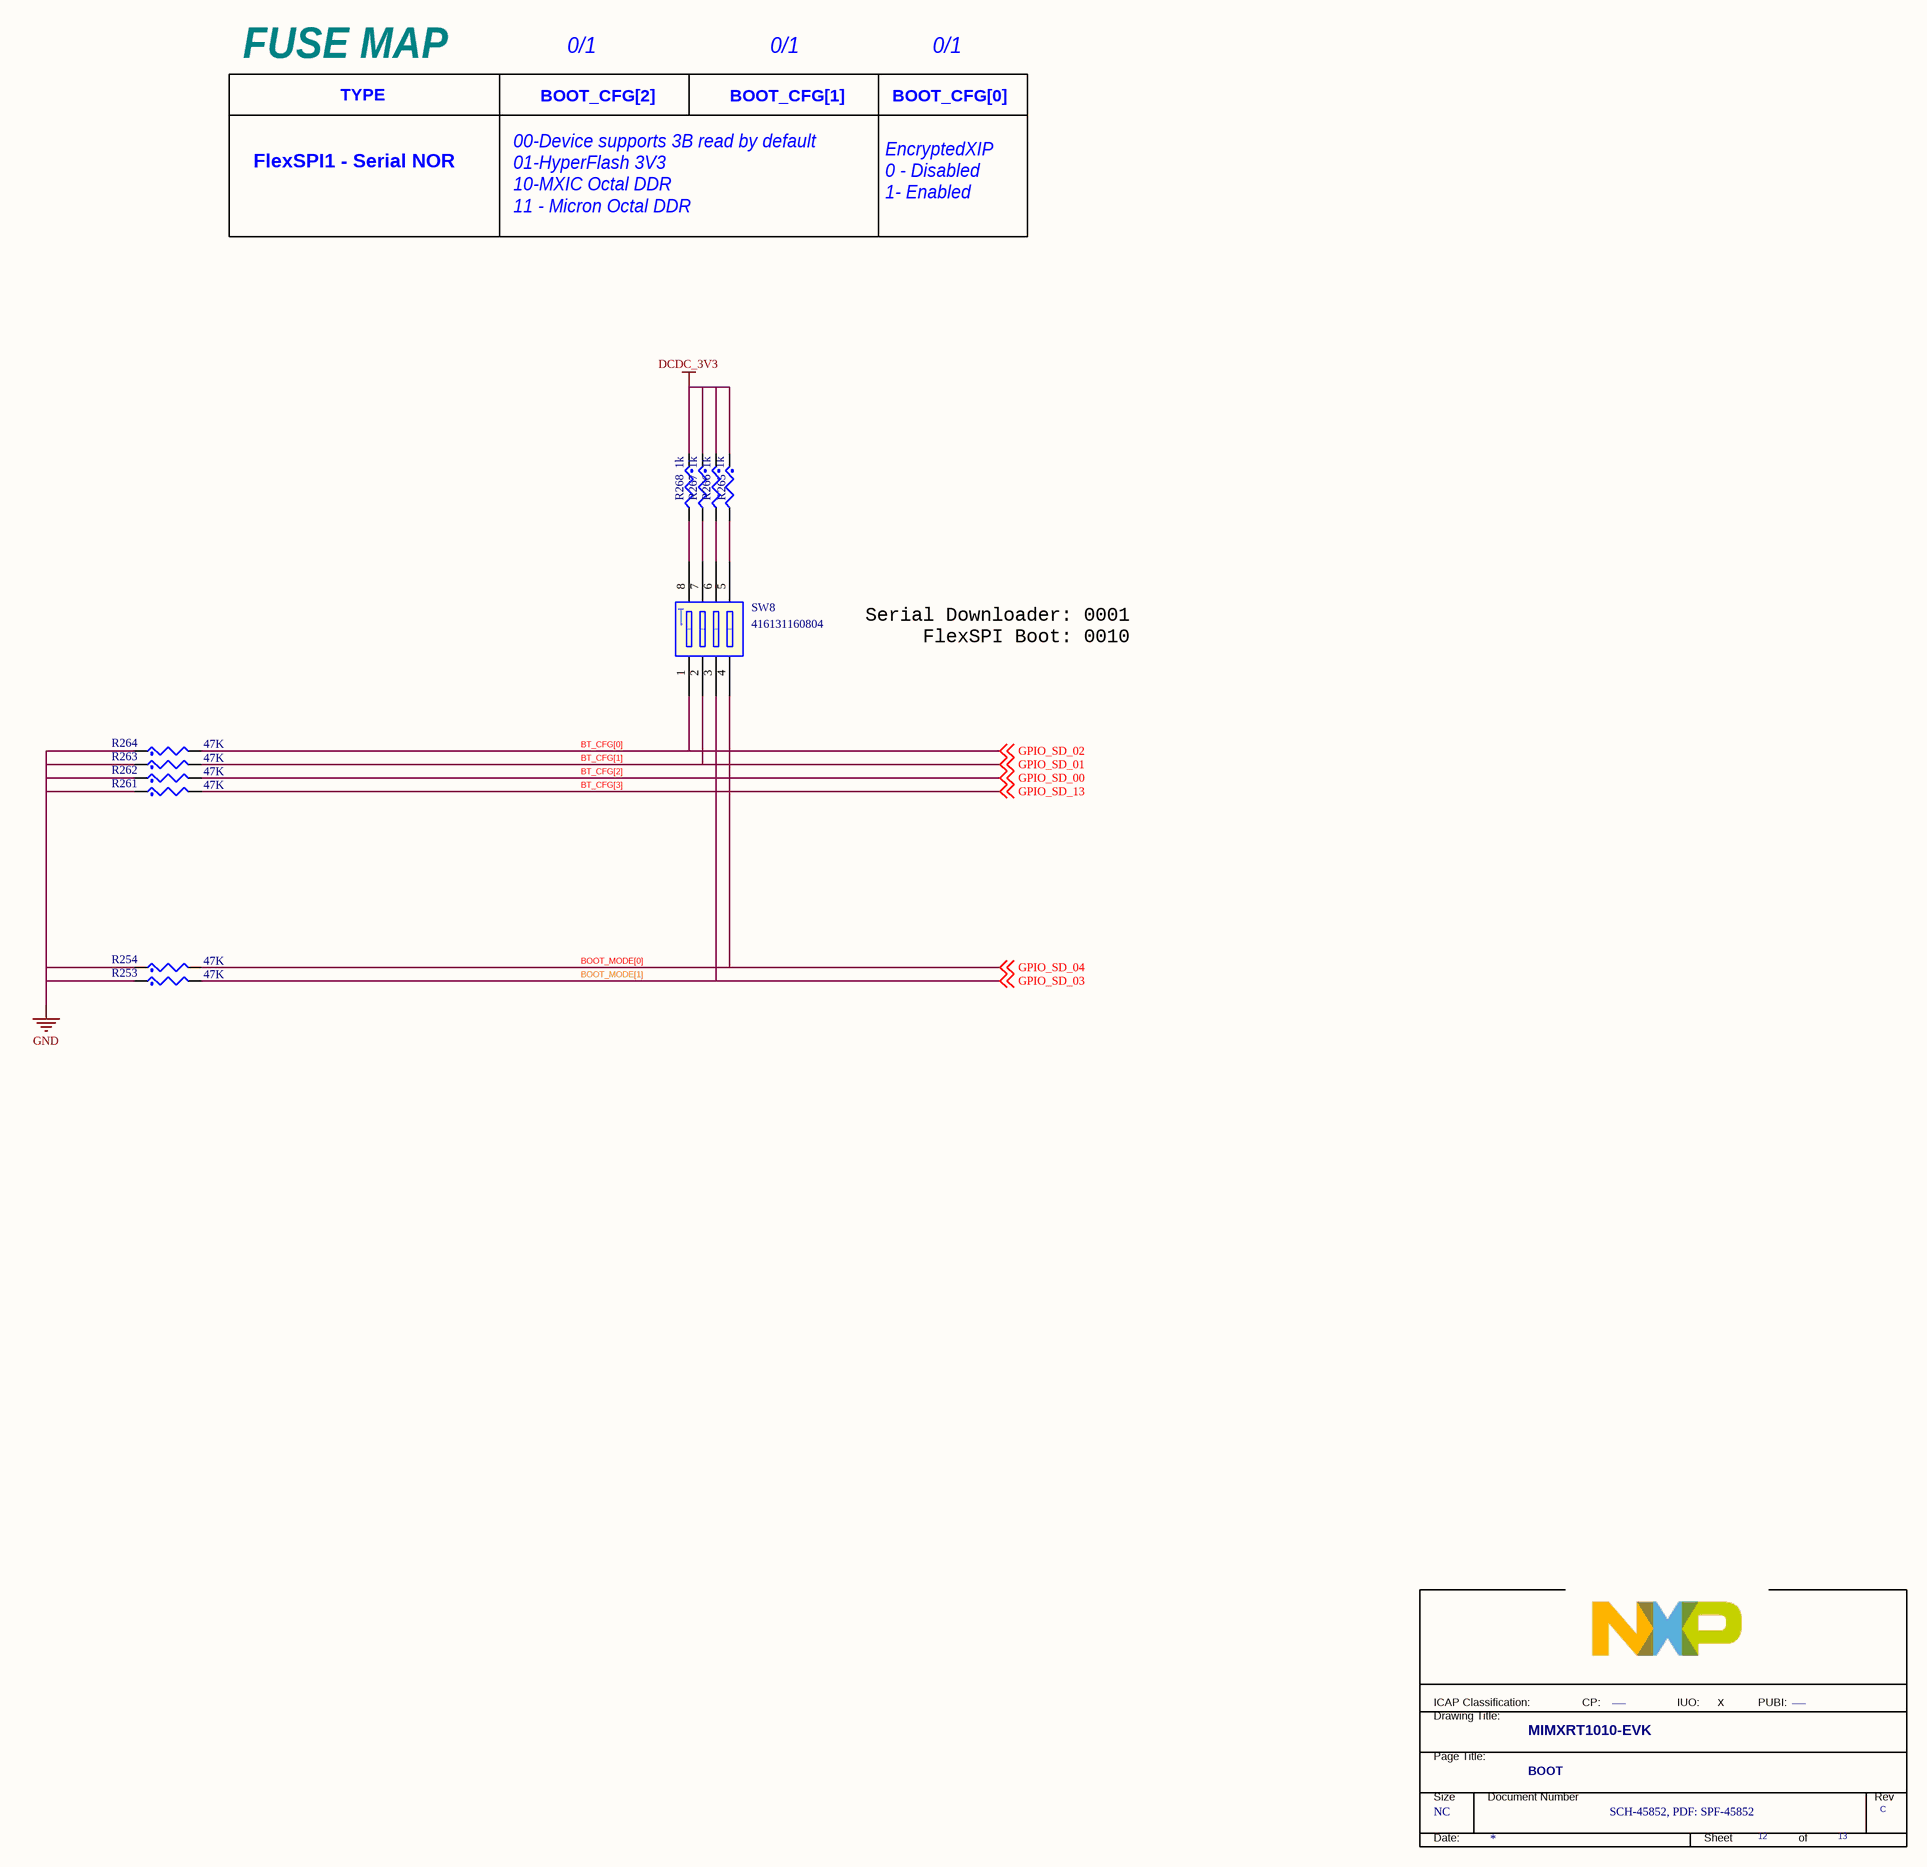
[diagram p16: 12 BOOT.SchDoc]

### Parts
(Parts that share a designator on the sheet are numbered #1, #2 ... from top to bottom, then left to right.)
*#12  PUBI: ___  Doc: SCH-45852, PDF: SPF-45852  RevCode: C  Title: MIMXRT1010-EVK  Page Size: NC  Page Number: 12  Page Count: 13  PageTitle: BOOT  (hidden comment: TitleBlock_FS)  (graphical)
R253  47K  [RC0402_25]
R254  47K  [RC0402_25]
R261  47K  [RC0402_25]
R262  47K  [RC0402_25]
R263  47K  [RC0402_25]
R264  47K  [RC0402_25]
R265  1k  [RC0402_25]
R266  1k  [RC0402_25]
R267  1k  [RC0402_25]
R268  1k  [RC0402_25]
SW8  416131160804  [sw4_dip_1p27_6p3x5p7]

### Nets
DCDC_3V3: R265.1 R266.1 R267.1 R268.1
GND: R253.1 R254.1 R261.1 R262.1 R263.1 R264.1
BOOT_MODE[0]: R254.2 SW8.4(A4) ; off-sheet GPIO_SD_04  [also labelled GPIO_SD_04]
BOOT_MODE[1]: R253.2 SW8.3(A3) ; off-sheet GPIO_SD_03  [also labelled GPIO_SD_03]
BT_CFG[0]: R264.2 SW8.1(A1) ; off-sheet GPIO_SD_02  [also labelled GPIO_SD_02]
BT_CFG[1]: R263.2 SW8.2(A2) ; off-sheet GPIO_SD_01  [also labelled GPIO_SD_01]
BT_CFG[2]: R262.2 ; off-sheet GPIO_SD_00  [also labelled GPIO_SD_00]
BT_CFG[3]: R261.2 ; off-sheet GPIO_SD_13  [also labelled GPIO_SD_13]
NetR265_2: R265.2 SW8.5(B4)
NetR266_2: R266.2 SW8.6(B3)
NetR267_2: R267.2 SW8.7(B2)
NetR268_2: R268.2 SW8.8(B1)

### Notes on the sheet
- 0/1
- FUSE MAP
- TYPE
- 00-Device supports 3B read by default
  01-HyperFlash 3V3
  10-MXIC Octal DDR
  11 - Micron Octal DDR
- BOOT_CFG[2]
- BOOT_CFG[1]
- BOOT_CFG[0]
- FlexSPI1 - Serial NOR
- EncryptedXIP
  0 - Disabled
  1- Enabled
- Serial Downloader: 0001
  FlexSPI Boot: 0010
- X
- (in symbol TitleBlock_FS) ICAP Classification:; CP:; IUO:; PUBI:; Drawing Title:; Page Title:; Size; Document Number; Rev; Date:; Sheet; of

### Library data of the parts
*#12 = TitleBlock_FS: FIUO: _X_; OrgName: Freescale Semiconductor; OrgAddr1: 6501 William Cannon Drive West; OrgAddr2: Austin, TX 78735-8598; FCP: ___; Page Create Date: March  8, 1995; Page Modify Date: *
R253 R262 R264 = RES_Dup1: RES MF 47K  1/16W 1% 0402; CLASS: DISCRETE; FPLIST: RC0402_25,RC0402_HD,0402_CC; CAD_APPROVED: Yes; Temp_Range: ¨C55 ¡ãC to +155 ¡ãC; MFG_PN01: RC0402FR-0747KL; MFG_NAME01: YAGEO AMERICA; AGILE_PN: 470-31023; PCB Footprint: RC0402_25; HEIGHT: 0.40 MM; ROHS: Yes; Tolerance: 1%
R254 R261 R263 = RES_Dup1: RES MF 47K  1/16W 1% 0402; CLASS: DISCRETE; AGILE_PN: 470-31023; MFG_NAME01: YAGEO AMERICA; MFG_PN01: RC0402FR-0747KL; Temp_Range: ¨C55 ¡ãC to +155 ¡ãC; CAD_APPROVED: Yes; FPLIST: RC0402_25,RC0402_HD,0402_CC; PCB Footprint: RC0402_25; Tolerance: 1%; ROHS: Yes; HEIGHT: 0.40 MM
R265-R267 = RES_Dup1: RES MF 1.0K 1/16W 5% 0402; CLASS: DISCRETE; FPLIST: RC0402_25,RC0402_HD,RC0402_X2,0402_CC; CAD_APPROVED: Yes; MFG_PN01: CRCW04021K00JNED; MFG_NAME01: VISHAY INTERTECHNOLOGY; AGILE_PN: 470-75555; PCB Footprint: RC0402_25; HEIGHT: 0.41mm; ROHS: Yes; Tolerance: 5%
R268 = RES_Dup1: as R155 on sheet 11 FREELINK; PCB Footprint: RC0402_25; Tolerance: 5%; ROHS: Yes; HEIGHT: 0.41mm
SW8 = SW_DIP4: SW DIP 4 POS 0.025A@24VDC SMT; CLASS: IC; AGILE_PN: 510-78047; MFG_NAME01: WURTH ELEKTRONIK EISOS GMBH & CO. KG (ELECTRONIC & ELECTROMEHANICAL COMP); CAD_APPROVED: Yes; PCB Footprint: sw4_dip_1p27_6p3x5p7; MFG_PN01: 416131160804; ROHS: Yes; HEIGHT: 2.1MM

## Sheet 13 MISC.SchDoc
size 513 x 386 mm
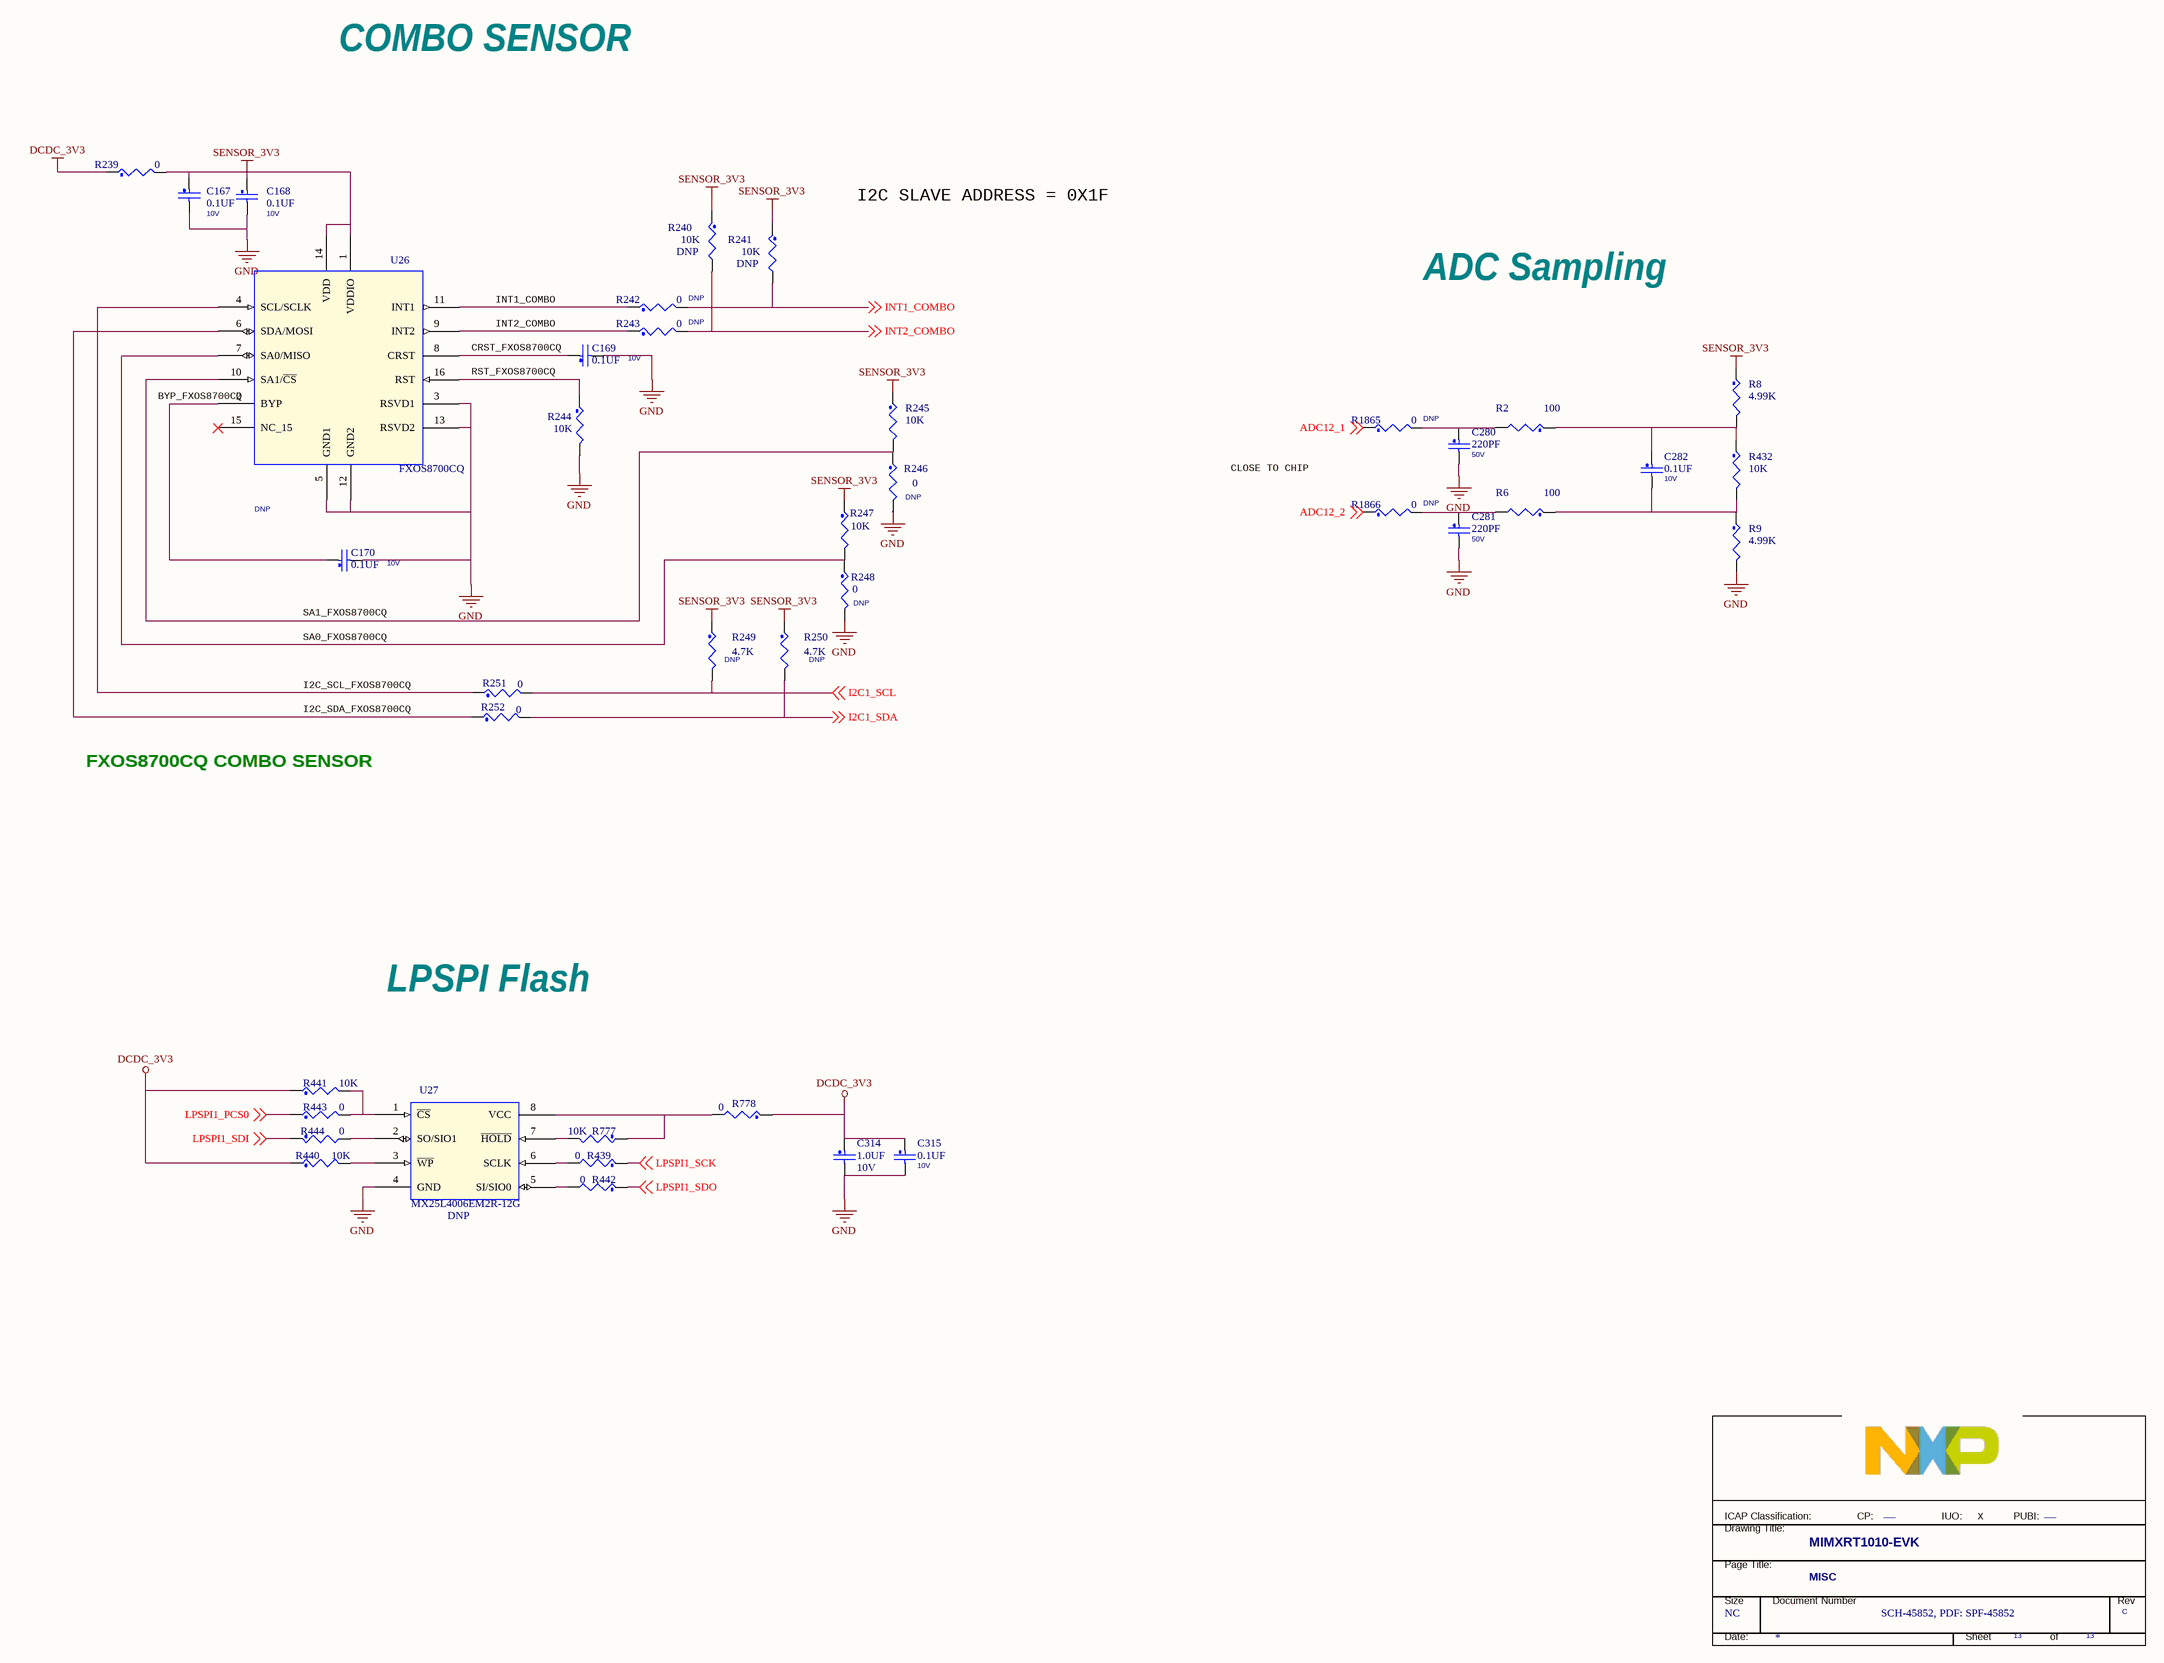
[diagram p17: 13 MISC.SchDoc]

### Parts
(Parts that share a designator on the sheet are numbered #1, #2 ... from top to bottom, then left to right.)
*#13  PUBI: ___  Doc: SCH-45852, PDF: SPF-45852  RevCode: C  Title: MIMXRT1010-EVK  Page Size: NC  Page Number: 13  PageTitle: MISC  (hidden comment: TitleBlock_FS)  (graphical)
C167  0.1UF  VOLTAGE: 10V  [CC0402_25]
C168  0.1UF  VOLTAGE: 10V  [CC0402_25]
C169  0.1UF  VOLTAGE: 10V  [CC0402_25]
C170  0.1UF  VOLTAGE: 10V  [CC0402_25]
C280  220PF  VOLTAGE: 50V  [CC0402_25]
C281  220PF  VOLTAGE: 50V  [CC0402_25]
C282  0.1UF  VOLTAGE: 10V  [CC0402_25]
C314  1.0UF  voltage rating: 10V  [0402_CC]
C315  0.1UF  VOLTAGE: 10V  [0402_CC]
R2  100  [RC0402_25]
R6  100  [RC0402_25]
R8  4.99K  [RC0402_25]
R9  4.99K  [RC0402_25]
R239  0  [0402_CC]
R240  10K  ASSY_OPT: DNP  [0402_CC]
R241  10K  ASSY_OPT: DNP  [0402_CC]
R242  0  ASSY_OPT: DNP  [0402_CC]
R243  0  ASSY_OPT: DNP  [0402_CC]
R244  10K  [0402_CC]
R245  10K  [0402_CC]
R246  0  ASSY_OPT: DNP  [0402_CC]
R247  10K  [0402_CC]
R248  0  ASSY_OPT: DNP  [0402_CC]
R249  4.7K  ASSY_OPT: DNP  [RC0402_25]
R250  4.7K  ASSY_OPT: DNP  [RC0402_25]
R251  0  [0402_CC]
R252  0  [0402_CC]
R432  10K  [0402_CC]
R439  0  [0402_CC]
R440  10K  [0402_CC]
R441  10K  [0402_CC]
R442  0  [0402_CC]
R443  0  [0402_CC]
R444  0  [0402_CC]
R777  10K  [0402_CC]
R778  0  [0402_CC]
R1865  0  ASSY_OPT: DNP  [0402_CC]
R1866  0  ASSY_OPT: DNP  [0402_CC]
U26  FXOS8700CQ  ASSY_OPT: DNP  [QFN5X3_0P5_3X3]
U27  MX25L4006EM2R-12G  ASSY_OPT: DNP  [SO8-25X75-200]

### Nets
DCDC_3V3: C314.1 C315.1 R239.1 R440.1 R441.1 R778.1
GND: C167.2 C168.2 C169.2 C170.2 C280.2 C281.2 C314.2 C315.2 R9.2 R244.2 R246.2 R248.2 U26.3(RSVD1) U26.5(GND1) U26.12(GND2) U26.13(RSVD2) U27.4(GND)
SENSOR_3V3: C167.1 C168.1 R8.1 R239.2 R240.1 R241.1 R245.1 R247.1 R249.1 R250.1 U26.1(VDDIO) U26.14(VDD)
ADC12_1: R1865.1 ; off-sheet ADC12_1
ADC12_2: R1866.1 ; off-sheet ADC12_2
I2C1_SCL: R249.2 R251.2 ; off-sheet I2C1_SCL
I2C1_SDA: R250.2 R252.2 ; off-sheet I2C1_SDA
INT1_COMBO: R241.2 R242.2 R443.1 ; off-sheet INT1_COMBO, off-sheet LPSPI1_PCS0  [also labelled LPSPI1_PCS0]
INT2_COMBO: R240.2 R243.2 R439.1 ; off-sheet INT2_COMBO, off-sheet LPSPI1_SCK  [also labelled LPSPI1_SCK]
LPSPI1_SDI: R444.1 ; off-sheet LPSPI1_SDI
LPSPI1_SDO: R442.1 ; off-sheet LPSPI1_SDO
NetC169_1: C169.1 U26.8(CRST)
NetC170_1: C170.1 U26.2(BYP)
NetC280_1: C280.1 R2.2 R1865.2
NetC281_1: C281.1 R6.2 R1866.2
NetC282_1: C282.1 R2.1 R8.2 R432.1
NetC282_2: C282.2 R6.1 R9.1 R432.2
NetR242_1: R242.1 U26.11(INT1)
NetR243_1: R243.1 U26.9(INT2)
NetR244_1: R244.1 U26.16(RST)
NetR245_2: R245.2 R246.1 U26.10(SA1/~{CS})
NetR247_2: R247.2 R248.1 U26.7(SA0/MISO)
NetR251_1: R251.1 U26.4(SCL/SCLK)
NetR252_1: R252.1 U26.6(SDA/MOSI)
NetR439_2: R439.2 U27.6(SCLK)
NetR440_2: R440.2 U27.3(~{WP})
NetR441_2: R441.2 R443.2 U27.1(~{CS})
NetR442_2: R442.2 U27.5(SI/SIO0)
NetR444_2: R444.2 U27.2(SO/SIO1)
NetR777_1: R777.1 R778.2 U27.8(VCC)
NetR777_2: R777.2 U27.7(~{HOLD})

Not connected (* = marked no-connect by the designer): U26 15(NC_15)*

### Notes on the sheet
- COMBO SENSOR
- I2C SLAVE ADDRESS = 0X1F
- ADC Sampling
- CRST_FXOS8700CQ
- INT1_COMBO
- (near C169) INT2_COMBO
- (near U26) BYP_FXOS8700CQ
- RST_FXOS8700CQ
- CLOSE TO CHIP
- SA1_FXOS8700CQ
- SA0_FXOS8700CQ
- I2C_SCL_FXOS8700CQ
- I2C_SDA_FXOS8700CQ
- FXOS8700CQ COMBO SENSOR
- LPSPI Flash
- X
- (in symbol TitleBlock_FS) ICAP Classification:; CP:; IUO:; PUBI:; Drawing Title:; Page Title:; Size; Document Number; Rev; Date:; Sheet; of

### Library data of the parts
*#13 = TitleBlock_FS: as *#11 on sheet 11 FREELINK; FCP: ___; Page Create Date: March  8, 1995; Page Count: 13; Page Modify Date: *
C167 C169 C282 = CAP_NP: as C259 on sheet 11 FREELINK; HEIGHT: 0.64MM; ROHS: Yes; Tolerance: 10%; PCB Footprint: CC0402_25
C168 C170 C315 = CAP_NP: as C135 on sheet 11 FREELINK; Tolerance: 10%; ROHS: Yes; HEIGHT: 0.64MM
  C168 C170: PCB Footprint: CC0402_25
  C315: PCB Footprint: 0402_CC
C280 = CAP_NP: CAP CER 220PF 50V 5% C0G 0402; CLASS: DISCRETE; FPLIST: CC0402_25,CC0402_HD,0402_CC; CAD_APPROVED: Yes; MFG_PN01: C0402C221J5GAC; MFG_NAME01: KEMET; AGILE_PN: 150-30297; HEIGHT: 0.55MM; ROHS: Yes; Tolerance: 5%; PCB Footprint: CC0402_25
C281 = CAP_NP: CAP CER 220PF 50V 5% C0G 0402; CLASS: DISCRETE; AGILE_PN: 150-30297; MFG_NAME01: KEMET; MFG_PN01: C0402C221J5GAC; CAD_APPROVED: Yes; FPLIST: CC0402_25,CC0402_HD,0402_CC; Tolerance: 5%; ROHS: Yes; HEIGHT: 0.55MM; PCB Footprint: CC0402_25
C314 = CAP_NP: CAP CER 1.0UF 10V 10% X5R 0402; CLASS: DISCRETE; FPLIST: CC0402_25,CC0402_HD,0402_CC; CAD_APPROVED: Yes; MFG_PN01: CC0402KRX5R6BB105; MFG_NAME01: YAGEO AMERICA; AGILE_PN: 150-75772; VOLTAGE: 10V; HEIGHT: 0.6MM; ROHS: Yes; PCB Footprint: 0402_CC
R2 R6 = RES_Dup1: RES MF 100 OHM 1/16W 1% 0402; CLASS: DISCRETE; AGILE_PN: 470-30454; MFG_NAME01: THYE MING TECH CO LTD; MFG_PN01: CR-02FL6--100R; CAD_APPROVED: Yes; FPLIST: RC0402_25,RC0402_HD,0402_CC; Tolerance: 1%; ROHS: Yes; TOL: 1%; HEIGHT: 0.4 MM; PCB Footprint: RC0402_25
R8 R9 = RES_Dup1: RES MF 4.99K 1/16W 1% 0402; CLASS: DISCRETE; FPLIST: RC0402_25,RC0402_HD,0402_CC; CAD_APPROVED: Yes; MFG_PN01: RC0402FR-074K99L; MFG_NAME01: YAGEO AMERICA; AGILE_PN: 470-81149; HEIGHT: 0.4 MM; ROHS: Yes; Tolerance: 1%; PCB Footprint: RC0402_25
R239 R242 R243 R248 R439 R442-R444 R1865 = RES_Dup1: as R148 on sheet 11 FREELINK; HEIGHT: 0.45 MM; Tolerance: 5%; ROHS: Yes; PCB Footprint: 0402_CC
R240 R241 R244 R440 R777 = RES_Dup1: as R156 on sheet 11 FREELINK; Tolerance: 5%; ROHS: Yes; HEIGHT: 0.4 MM; PCB Footprint: 0402_CC
R245 R247 R432 R441 = RES_Dup1: as R129 on sheet 11 FREELINK; HEIGHT: 0.4 MM; ROHS: Yes; Tolerance: 5%; PCB Footprint: 0402_CC
R246 R251 R252 R778 R1866 = RES_Dup1: as R144 on sheet 11 FREELINK; ROHS: Yes; Tolerance: 5%; HEIGHT: 0.45 MM; PCB Footprint: 0402_CC
R249 R250 = RES_Dup1: RES MF 4.7K 1/16W 5% 0402; CLASS: DISCRETE; FPLIST: RC0402_25,RC0402_HD,0402_CC; CAD_APPROVED: Yes; MFG_PN01: NRCL04J472TRF; MFG_NAME01: NIC COMPONENTS CORP; AGILE_PN: 470-75626; PCB Footprint: RC0402_25; HEIGHT: 0.41mm; ROHS: Yes; Tolerance: 5%
U26 = FXOS8700CQ_QFN_16P: IC ACCELEROMETER AND MAGNETOMETER SENSOR 3-AXIS 2.5V QFN16; FPLIST: QFN5X3_0P5_3X3,QFN5X3_0P5_3X3_a; CAD_APPROVED: Yes; MFG_NAME01: Freescale Semiconductor; AGILE_PN: 312-80418; CLASS: IC; HEIGHT: 1.25MM; ROHS: Yes; MFG_PN01: FXOS8700CQ; PCB Footprint: QFN5X3_0P5_3X3
U27 = MX25L6406EM2I_SOP8: IC MEM FLASH SPI 4MBIT 86MHZ 2.7-3.6V AUTOMOTIVE SOP8; AGILE_PN: 334-77823; MFG_NAME01: MACRONIX INTERNATIONAL CO., LTD; Temp_Range: -40¡ãC ~ 105¡ãC; CAD_APPROVED: Yes; CLASS: IC; MFG_PN01: MX25L4006EM2R-12G; ROHS: Yes; HEIGHT: 2.16MM; PCB Footprint: SO8-25X75-200

## Nets that join several sheets
5V_SYS: 03 MAIN POWER (9 pins), 06 USB (R62.1), 07 SAI (R82.1), 10 ARDUINO_JTAG (D8.A J60.16)
5V_USB_OTG: 05 MIMXRT1010 PART2 (C78.1 U1.29), 06 USB (7 pins)
5V_USB_OTG_S: 03 MAIN POWER (J1.3), 06 USB (R312.2)
DCDC_3V3: 03 MAIN POWER (5 pins), 04 MIMXRT1010 PART1 (R20.1 R433.1), 05 MIMXRT1010 PART2 (R56.1), 06 USB (R64.1 R66.1 R781.1), 07 SAI (R80.1), 08 SPDIF (J35.2), 09 FLEXSPI FLASH (R142.1), 10 ARDUINO_JTAG (7 pins), 11 FREELINK (16 pins), 12 BOOT (R265.1 R266.1 R267.1 R268.1), 13 MISC (6 pins)
GND: 03 MAIN POWER (38 pins), 04 MIMXRT1010 PART1 (52 pins), 05 MIMXRT1010 PART2 (14 pins), 06 USB (13 pins), 07 SAI (39 pins), 08 SPDIF (8 pins), 09 FLEXSPI FLASH (C142.2 C143.2 U13.4), 10 ARDUINO_JTAG (12 pins), 11 FREELINK (62 pins), 12 BOOT (6 pins), 13 MISC (17 pins)
MCU_DCDC_IN_3V3: 03 MAIN POWER (C55.1 R47.2), 04 MIMXRT1010 PART1 (J37.2 R357.2)
P5V_SDA_S: 03 MAIN POWER (J1.1), 11 FREELINK (R177.2 R178.2)
VDD_HIGH_IN_3V3: 03 MAIN POWER (C56.1 R45.2), 04 MIMXRT1010 PART1 (J5.1 R14.1)
VDD_SNVS_3V3: 03 MAIN POWER (5 pins), 04 MIMXRT1010 PART1 (D4.A)
VDDA_ADC_3V3: 03 MAIN POWER (C47.1 R35.2), 04 MIMXRT1010 PART1 (J3.1 R12.1)
ADC12_1: 05 MIMXRT1010 PART2 (U1.59), 10 ARDUINO_JTAG (R294.2 R1833.2 R1849.1), 13 MISC (R1865.1)
ADC12_2: 05 MIMXRT1010 PART2 (U1.58), 10 ARDUINO_JTAG (R7.2 R290.2 R1850.1), 13 MISC (R1866.1)
ADC12_3: 05 MIMXRT1010 PART2 (U1.51), 10 ARDUINO_JTAG (R278.2 R1852.1)
ADC12_6: 05 MIMXRT1010 PART2 (U1.43), 10 ARDUINO_JTAG (R1840.2)
AUD_INT: 04 MIMXRT1010 PART1 (R1874.2), 05 MIMXRT1010 PART2 (U1.13), 07 SAI (R83.1 R84.1)
BOOT_MODE[0]: 05 MIMXRT1010 PART2 (U1.72), 12 BOOT (R254.2 SW8.4)
BOOT_MODE[1]: 05 MIMXRT1010 PART2 (U1.73), 12 BOOT (R253.2 SW8.3)
BT_CFG[0]: 05 MIMXRT1010 PART2 (TP34.1 U1.74), 10 ARDUINO_JTAG (R1845.2), 12 BOOT (R264.2 SW8.1)
BT_CFG[1]: 05 MIMXRT1010 PART2 (TP31.1 U1.75), 12 BOOT (R263.2 SW8.2)
BT_CFG[2]: 05 MIMXRT1010 PART2 (U1.76), 12 BOOT (R262.2)
BT_CFG[3]: 05 MIMXRT1010 PART2 (U1.61), 12 BOOT (R261.2)
FLEXPWM1_PWMA0: 05 MIMXRT1010 PART2 (R794.2), 10 ARDUINO_JTAG (J60.15 R1855.1)
FLEXPWM1_PWMA1: 05 MIMXRT1010 PART2 (R796.2), 10 ARDUINO_JTAG (J60.11 R1857.1 R1872.1 R1875.1)
FLEXPWM1_PWMA2: 05 MIMXRT1010 PART2 (R798.2), 10 ARDUINO_JTAG (J60.7 R1859.1 R1860.1)
FLEXPWM1_PWMA3: 05 MIMXRT1010 PART2 (R800.2), 10 ARDUINO_JTAG (R5.2)
FLEXPWM1_PWMB0: 05 MIMXRT1010 PART2 (R793.2), 10 ARDUINO_JTAG (J60.13 R4.2)
FLEXPWM1_PWMB1: 05 MIMXRT1010 PART2 (R795.2), 10 ARDUINO_JTAG (J60.9 R10.2)
FLEXPWM1_PWMB2: 05 MIMXRT1010 PART2 (R797.2), 10 ARDUINO_JTAG (J60.5 R1858.1)
FLEXPWM1_PWMB3: 05 MIMXRT1010 PART2 (R799.2), 10 ARDUINO_JTAG (R1861.1 R1862.1)
FlexSPI_CLK_A: 05 MIMXRT1010 PART2 (U1.65), 09 FLEXSPI FLASH (U13.6)
FlexSPI_D0_A: 05 MIMXRT1010 PART2 (U1.66), 09 FLEXSPI FLASH (U13.5)
FlexSPI_D1_A: 05 MIMXRT1010 PART2 (U1.68), 09 FLEXSPI FLASH (U13.2)
FlexSPI_D2_A: 05 MIMXRT1010 PART2 (U1.67), 09 FLEXSPI FLASH (R438.2 U13.3)
FlexSPI_D3_A: 05 MIMXRT1010 PART2 (U1.64), 09 FLEXSPI FLASH (R313.2 U13.7)
FlexSPI_SS0: 05 MIMXRT1010 PART2 (U1.69), 09 FLEXSPI FLASH (R143.2 U13.1)
GPIO_11: 04 MIMXRT1010 PART1 (R1870.2), 05 MIMXRT1010 PART2 (U1.1), 08 SPDIF (J54.2)
I2C1_SCL: 05 MIMXRT1010 PART2 (R801.2), 07 SAI (R92.2 U10.17), 10 ARDUINO_JTAG (R338.2), 13 MISC (R249.2 R251.2)
I2C1_SDA: 05 MIMXRT1010 PART2 (R802.2), 07 SAI (R93.2 U10.18), 10 ARDUINO_JTAG (R359.2), 13 MISC (R250.2 R252.2)
INT1_COMBO: 05 MIMXRT1010 PART2 (U1.55), 10 ARDUINO_JTAG (R11.2 R805.2 R1843.1), 13 MISC (R241.2 R242.2 R443.1)
INT2_COMBO: 05 MIMXRT1010 PART2 (U1.52), 10 ARDUINO_JTAG (R1.2 R1844.1 R1848.2), 13 MISC (R240.2 R243.2 R439.1)
JTAG_MOD: 03 MAIN POWER (C61.1), 05 MIMXRT1010 PART2 (R303.1 U1.46)
JTAG_TCK: 05 MIMXRT1010 PART2 (U1.45), 10 ARDUINO_JTAG (J55.4), 11 FREELINK (J62.2)
JTAG_TDI: 05 MIMXRT1010 PART2 (U1.47), 10 ARDUINO_JTAG (J55.8 R1841.2 R1854.1), 11 FREELINK (J63.2)
JTAG_TDO: 05 MIMXRT1010 PART2 (U1.48), 10 ARDUINO_JTAG (J55.6 R276.2 R1853.1), 11 FREELINK (J64.2)
JTAG_TMS: 05 MIMXRT1010 PART2 (U1.44), 10 ARDUINO_JTAG (J55.2 R436.2), 11 FREELINK (J61.2)
JTAG_TRSTB: 05 MIMXRT1010 PART2 (U1.49), 10 ARDUINO_JTAG (J55.10 R437.2)
LPSPI1_SDI: 05 MIMXRT1010 PART2 (R1863.2 U1.57), 10 ARDUINO_JTAG (R1847.2), 13 MISC (R444.1)
LPSPI1_SDO: 05 MIMXRT1010 PART2 (R1864.2 U1.56), 10 ARDUINO_JTAG (R1846.2), 13 MISC (R442.1)
LPUART1_RXD: 05 MIMXRT1010 PART2 (U1.3), 10 ARDUINO_JTAG (R804.2), 11 FREELINK (J32.2 R237.2)
LPUART1_TXD: 05 MIMXRT1010 PART2 (TP32.1 U1.2), 08 SPDIF (J36.1), 10 ARDUINO_JTAG (R3.2), 11 FREELINK (J31.2 R236.2)
OTG1_DN: 05 MIMXRT1010 PART2 (U1.32), 06 USB (L4.1 R61.2)
OTG1_DP: 05 MIMXRT1010 PART2 (U1.33), 06 USB (L4.4 R63.2)
PMIC_ON_REQ: 03 MAIN POWER (R41.2), 04 MIMXRT1010 PART1 (U1.24)
POR_B: 04 MIMXRT1010 PART1 (C28.1 R22.2 R26.2 U1.22), 10 ARDUINO_JTAG (J30.1), 11 FREELINK (5 pins)
POR_BUTTON: 03 MAIN POWER (R50.1), 04 MIMXRT1010 PART1 (C173.1 SW3.3 SW3.4)
SAI1_MCLK: 05 MIMXRT1010 PART2 (R792.2), 07 SAI (R90.1)
SAI1_RX_BCLK: 05 MIMXRT1010 PART2 (R785.2), 07 SAI (R780.1)
SAI1_RX_SYNC: 05 MIMXRT1010 PART2 (R786.2), 07 SAI (R779.1)
SAI1_RXD0: 05 MIMXRT1010 PART2 (R787.2), 07 SAI (R88.1)
SAI1_TX_BCLK: 05 MIMXRT1010 PART2 (R790.2), 07 SAI (R87.1 R780.2)
SAI1_TX_SYNC: 05 MIMXRT1010 PART2 (R791.2), 07 SAI (R85.1 R779.2)
SAI1_TXD0: 05 MIMXRT1010 PART2 (R788.2), 07 SAI (R280.1)
SAI1_TXD1: 05 MIMXRT1010 PART2 (R789.2), 07 SAI (R281.1)
USB_OTG1_ID: 05 MIMXRT1010 PART2 (U1.79), 06 USB (Q9.2 R68.2 R781.2)
USB_OTG1_OC: 05 MIMXRT1010 PART2 (U1.80), 06 USB (R65.1)
USB_OTG1_PWR: 05 MIMXRT1010 PART2 (U1.60), 06 USB (R69.1)
USER_BUTTON: 04 MIMXRT1010 PART1 (R1873.2), 05 MIMXRT1010 PART2 (U1.70), 10 ARDUINO_JTAG (R1839.1)